# EAGLE design SegmentDriver_nh_teensy36 (EAGLE 7.7.0)

## Sheet 1 of 8: Power
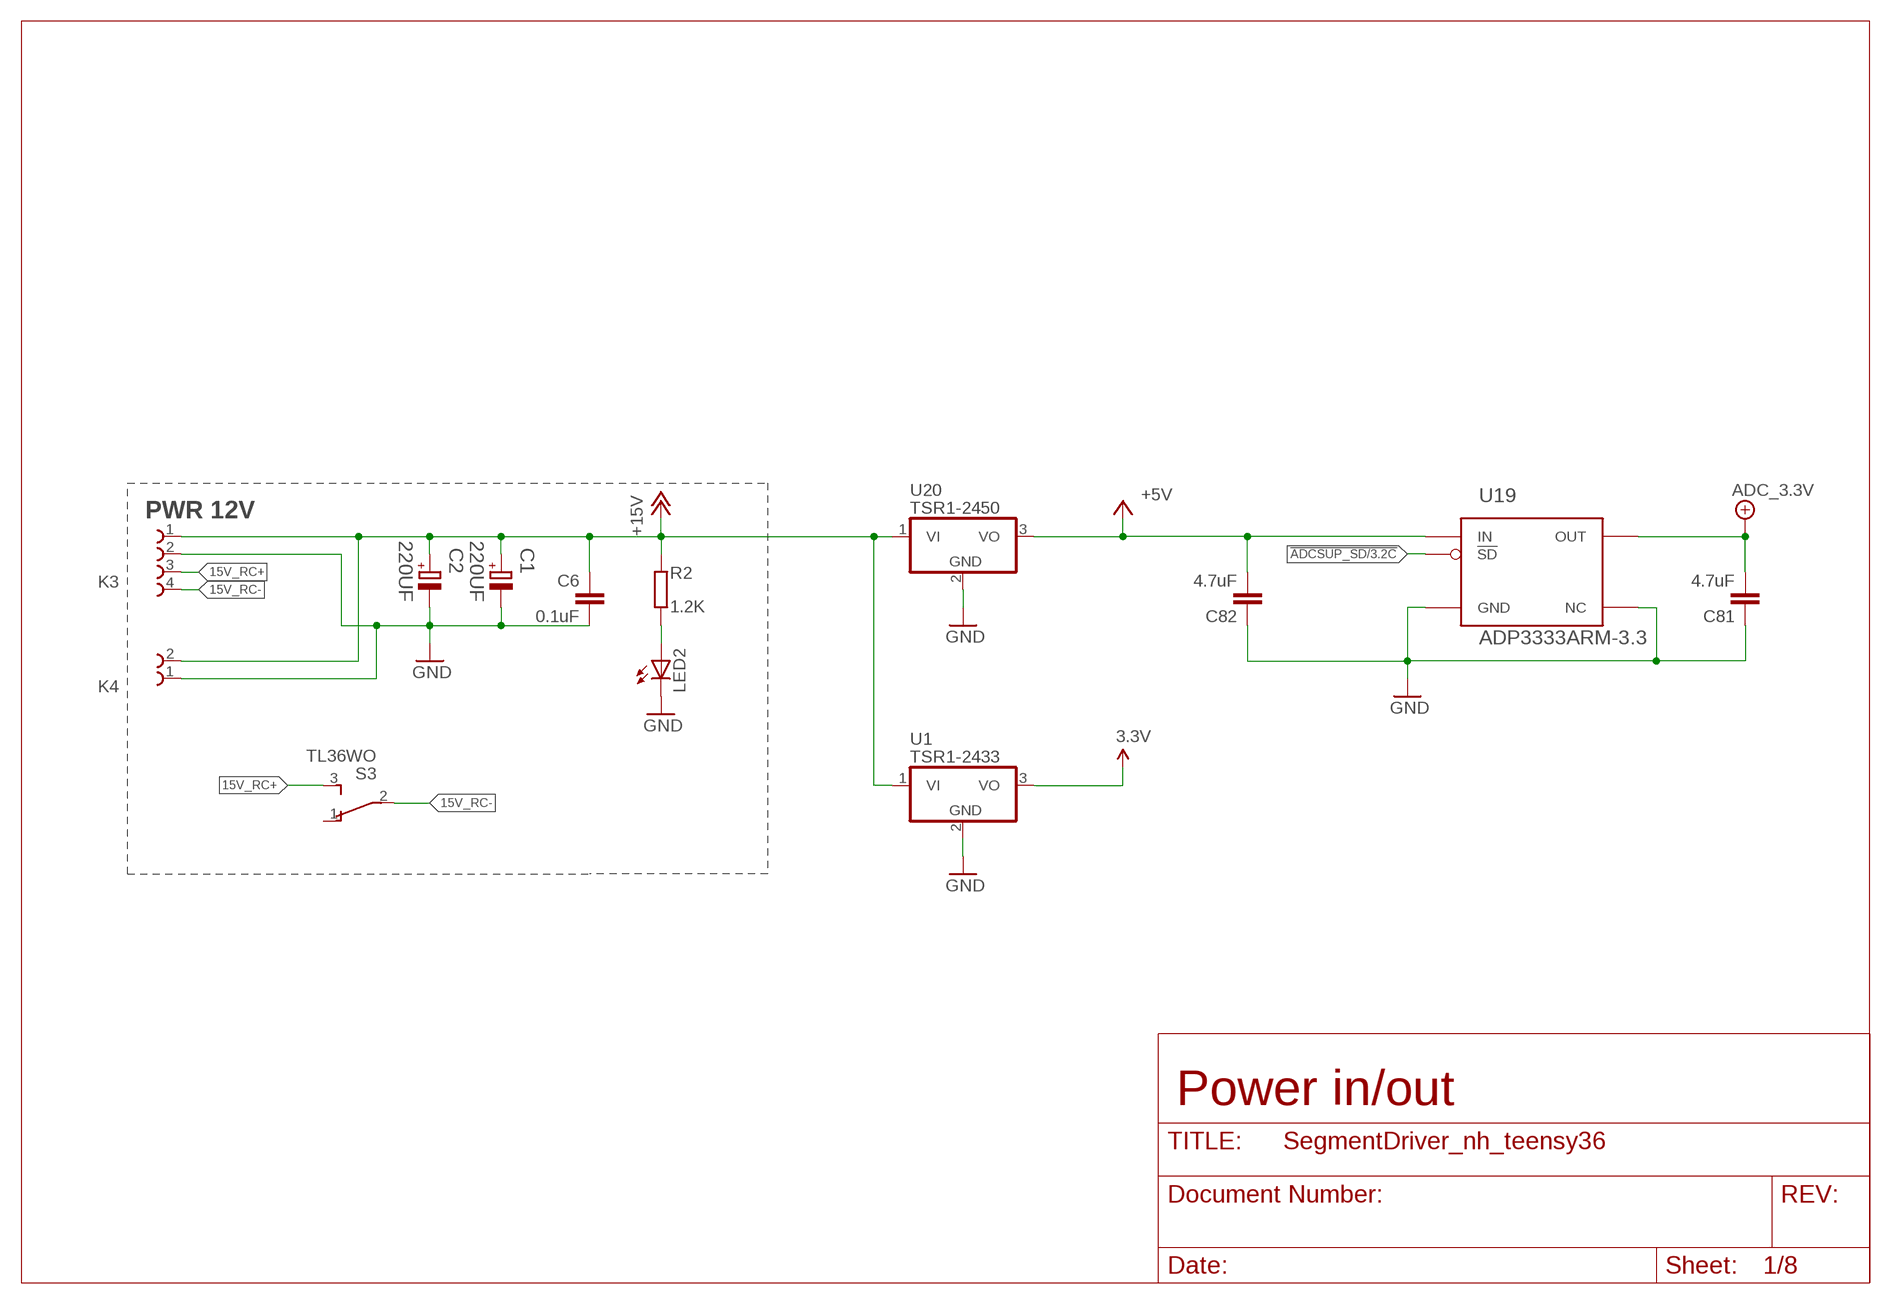
[diagram p0: schematic, sheet 1]

### Parts
C1  220UF  EEE-FP1V221AP-CASE-F  [CAPAE830X1050N]
C2  220UF  EEE-FP1V221AP-CASE-F  [CAPAE830X1050N]
C6  0.1uF  C-EUC0603K  [C0603K]
C81  4.7uF  C-EUC0603K  [C0603K]
C82  4.7uF  C-EUC0805K  [C0805K]
K3  691322310004  [691322310004]
K4  691322310002  [691322310002]
LED2  LEDCHIPLED_0603  [CHIPLED_0603]
R2  1.2K  R-EU_R0603  [R0603]
S3  TL36WO  [TL3XWO]
U1  TSR1-2433  78XXTSR1-24XX  [TO220V_TR1]
U19  ADP3333ARM-3.3  ADP3333ARM-5  [MSOP-8]
U20  TSR1-2450  78XXTSR1-24XX  [TO220V_TR1]

### Nets
3.3V: U1.3(VO) ; also sheet 2,4,7
15V_RC+: K3.3 S3.3(S)
15V_RC-: K3.4 S3.2(P)
!ADCSUP_SD: U19.7(!SD!) ; also sheet 3
+5V: C82.2 U19.2(IN) U20.3(VO) ; also sheet 7
+15V: C1.1 C2.1 C6.2 K3.1 K4.2 R2.2 U1.1(VI) U20.1(VI) ; also sheet 4
ADC_3.3V: C81.2 U19.1(OUT) ; also sheet 5
GND: C1.2 C2.2 C6.1 C81.1 C82.1 K3.2 K4.1 LED2.C U1.2(GND) U19.3(GND) U19.4(NC) U19.5(NC) U19.6(NC) U19.8(NC) U20.2(GND) ; also sheet 2,3,4,5,6,7,8
N$62: LED2.A R2.1
Unconnected: S3.1(O)

### Notes on the sheet
- PWR 12V
- Power in/out

## Sheet 2 of 8: Connectors
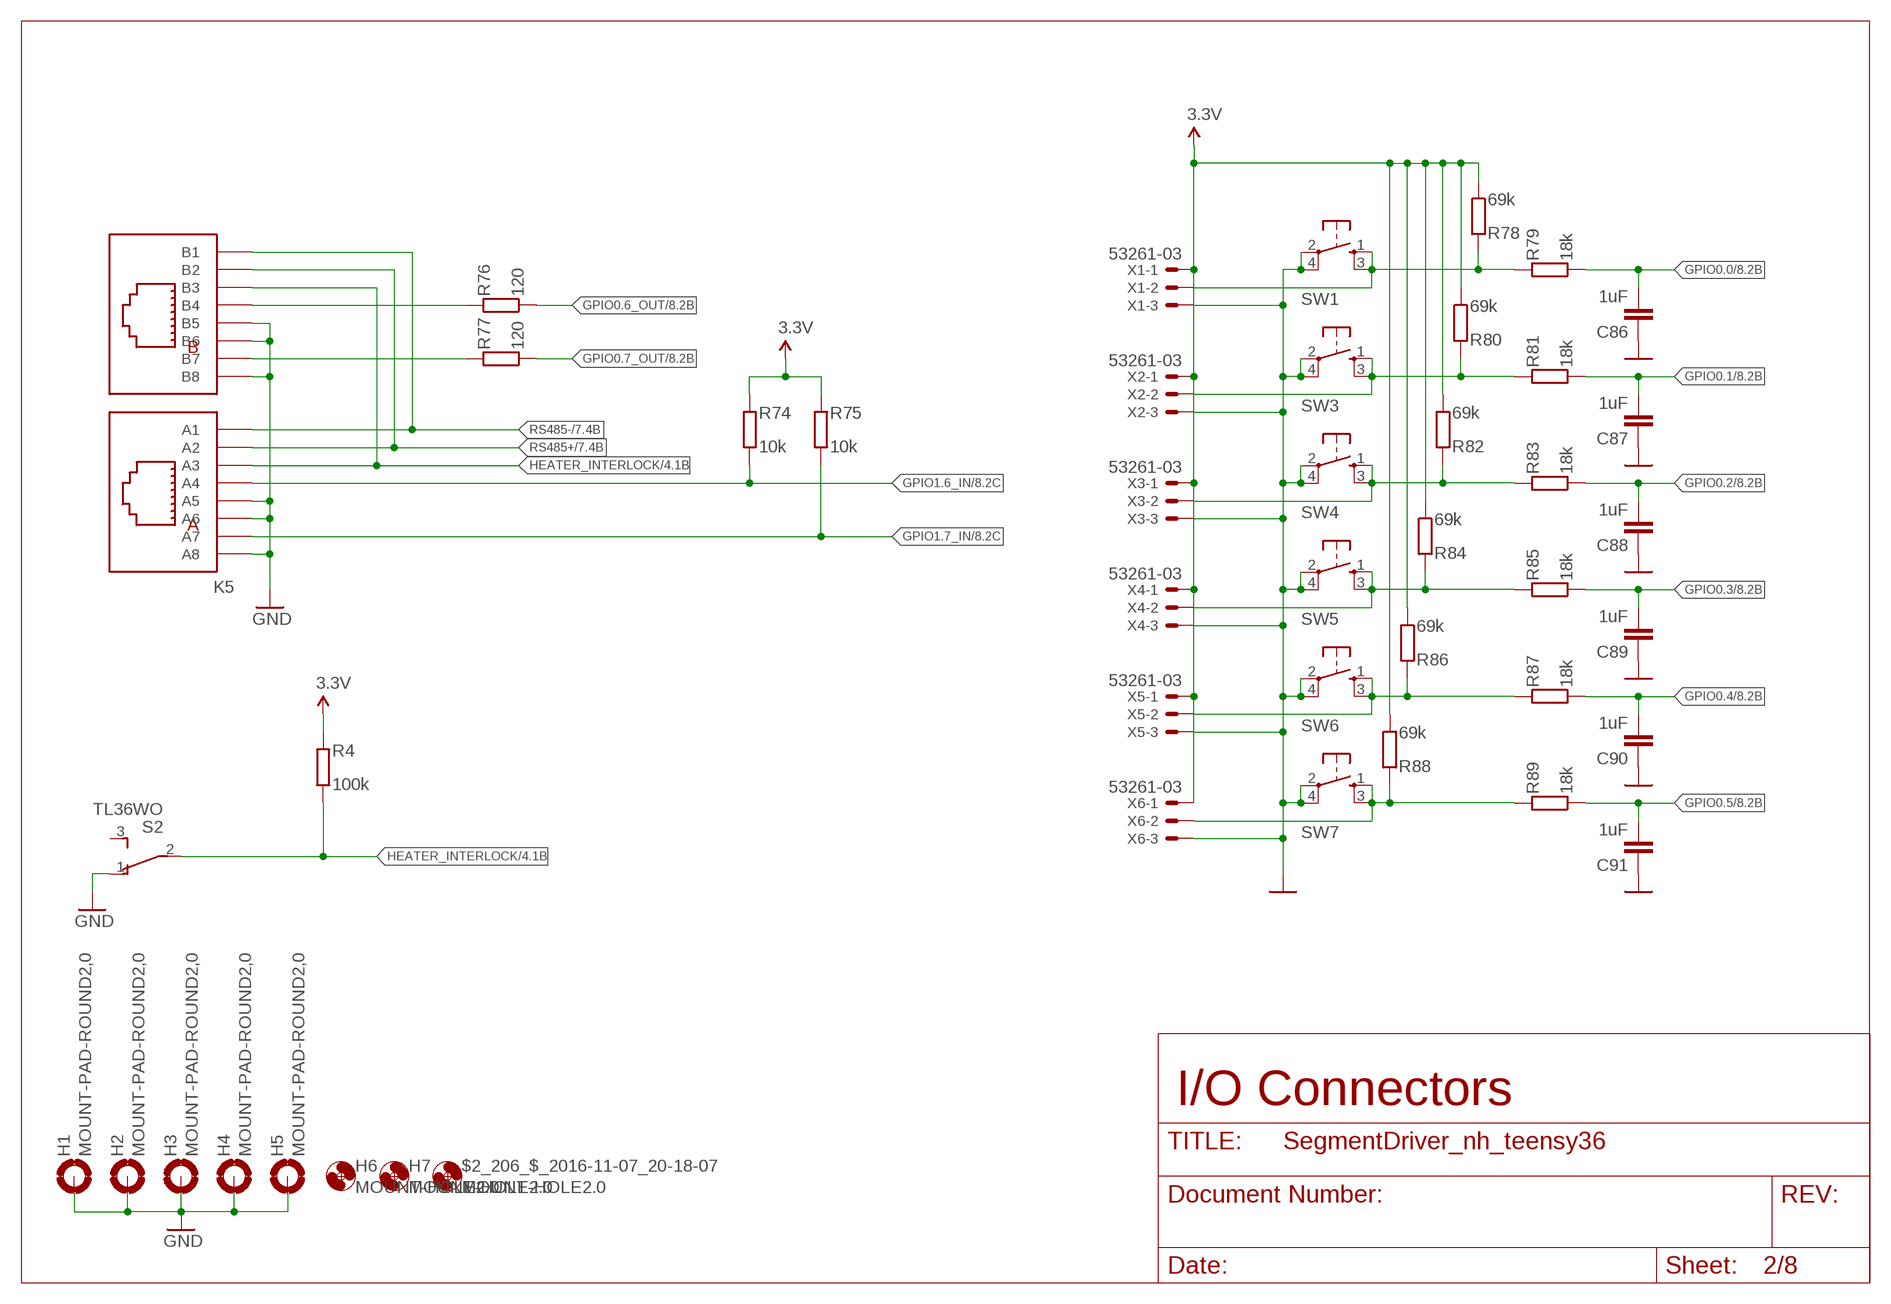
[diagram p1: schematic, sheet 2]

### Parts
$2_206_$_2016-11-07_20-18-07  MOUNT-HOLE2.0  [2,0]
C86  1uF  C-EUC0603K  [C0603K]
C87  1uF  C-EUC0603K  [C0603K]
C88  1uF  C-EUC0603K  [C0603K]
C89  1uF  C-EUC0603K  [C0603K]
C90  1uF  C-EUC0603K  [C0603K]
C91  1uF  C-EUC0603K  [C0603K]
H1  MOUNT-PAD-ROUND2,0  [2,0-PAD]
H2  MOUNT-PAD-ROUND2,0  [2,0-PAD]
H3  MOUNT-PAD-ROUND2,0  [2,0-PAD]
H4  MOUNT-PAD-ROUND2,0  [2,0-PAD]
H5  MOUNT-PAD-ROUND2,0  [2,0-PAD]
H6  MOUNT-HOLE2.0  [2,0]
H7  MOUNT-HOLE2.0  [2,0]
K5  615016149521  [615016149521]
R4  100k  R-EU_R0603  [R0603]
R74  10k  R-EU_R0603  [R0603]
R75  10k  R-EU_R0603  [R0603]
R76  120  R-EU_R0603  [R0603]
R77  120  R-EU_R0603  [R0603]
R78  69k  R-EU_R0603  [R0603]
R79  18k  R-EU_R0603  [R0603]
R80  69k  R-EU_R0603  [R0603]
R81  18k  R-EU_R0603  [R0603]
R82  69k  R-EU_R0603  [R0603]
R83  18k  R-EU_R0603  [R0603]
R84  69k  R-EU_R0603  [R0603]
R85  18k  R-EU_R0603  [R0603]
R86  69k  R-EU_R0603  [R0603]
R87  18k  R-EU_R0603  [R0603]
R88  69k  R-EU_R0603  [R0603]
R89  18k  R-EU_R0603  [R0603]
S2  TL36WO  [TL3XWO]
SW1  434153017835_FIXED  [434153017835]
SW3  434153017835_FIXED  [434153017835]
SW4  434153017835_FIXED  [434153017835]
SW5  434153017835_FIXED  [434153017835]
SW6  434153017835_FIXED  [434153017835]
SW7  434153017835_FIXED  [434153017835]
X1  53261-03  [53261-03]
X2  53261-03  [53261-03]
X3  53261-03  [53261-03]
X4  53261-03  [53261-03]
X5  53261-03  [53261-03]
X6  53261-03  [53261-03]

### Nets
3.3V: R4.2 R74.2 R75.2 R78.1 R80.1 R82.1 R84.1 R86.1 R88.1 X1.1 X2.1 X3.1 X4.1 X5.1 X6.1 ; also sheet 1,4,7
GND: C86.1 C87.1 C88.1 C89.1 C90.1 C91.1 H1.B2,2(MOUNT) H2.B2,2(MOUNT) H3.B2,2(MOUNT) H4.B2,2(MOUNT) H5.B2,2(MOUNT) K5.A5 K5.A6 K5.A8 K5.B5 K5.B6 K5.B8 S2.1(O) SW1.2 SW1.4 SW3.2 SW3.4 SW4.2 SW4.4 SW5.2 SW5.4 SW6.2 SW6.4 SW7.2 SW7.4 X1.3 X2.3 X3.3 X4.3 X5.3 X6.3 ; also sheet 1,3,4,5,6,7,8
GPIO0.0: C86.2 R79.1 ; also sheet 8
GPIO0.1: C87.2 R81.1 ; also sheet 8
GPIO0.2: C88.2 R83.1 ; also sheet 8
GPIO0.3: C89.2 R85.1 ; also sheet 8
GPIO0.4: C90.2 R87.1 ; also sheet 8
GPIO0.5: C91.2 R89.1 ; also sheet 8
GPIO0.6_OUT: R76.1 ; also sheet 8
GPIO0.7_OUT: R77.1 ; also sheet 8
GPIO1.6_IN: K5.A4 R74.1 ; also sheet 8
GPIO1.7_IN: K5.A7 R75.1 ; also sheet 8
GPIO6_OUT: K5.B4 R76.2
GPIO7_OUT: K5.B7 R77.2
HEATER_INTERLOCK: K5.A3 R4.1 S2.2(P) ; also sheet 4
N$2: K5.B3
N$64: R78.2 R79.2 SW1.1 SW1.3 X1.2
N$66: R80.2 R81.2 SW3.1 SW3.3 X2.2
N$68: R82.2 R83.2 SW4.1 SW4.3 X3.2
N$70: R84.2 R85.2 SW5.1 SW5.3 X4.2
N$72: R86.2 R87.2 SW6.1 SW6.3 X5.2
N$79: R88.2 R89.2 SW7.1 SW7.3 X6.2
RS485+: K5.A2 K5.B2 ; also sheet 7
RS485-: K5.A1 K5.B1 ; also sheet 7
Unconnected: S2.3(S)

### Notes on the sheet
- I/O Connectors

## Sheet 3 of 8: MCU
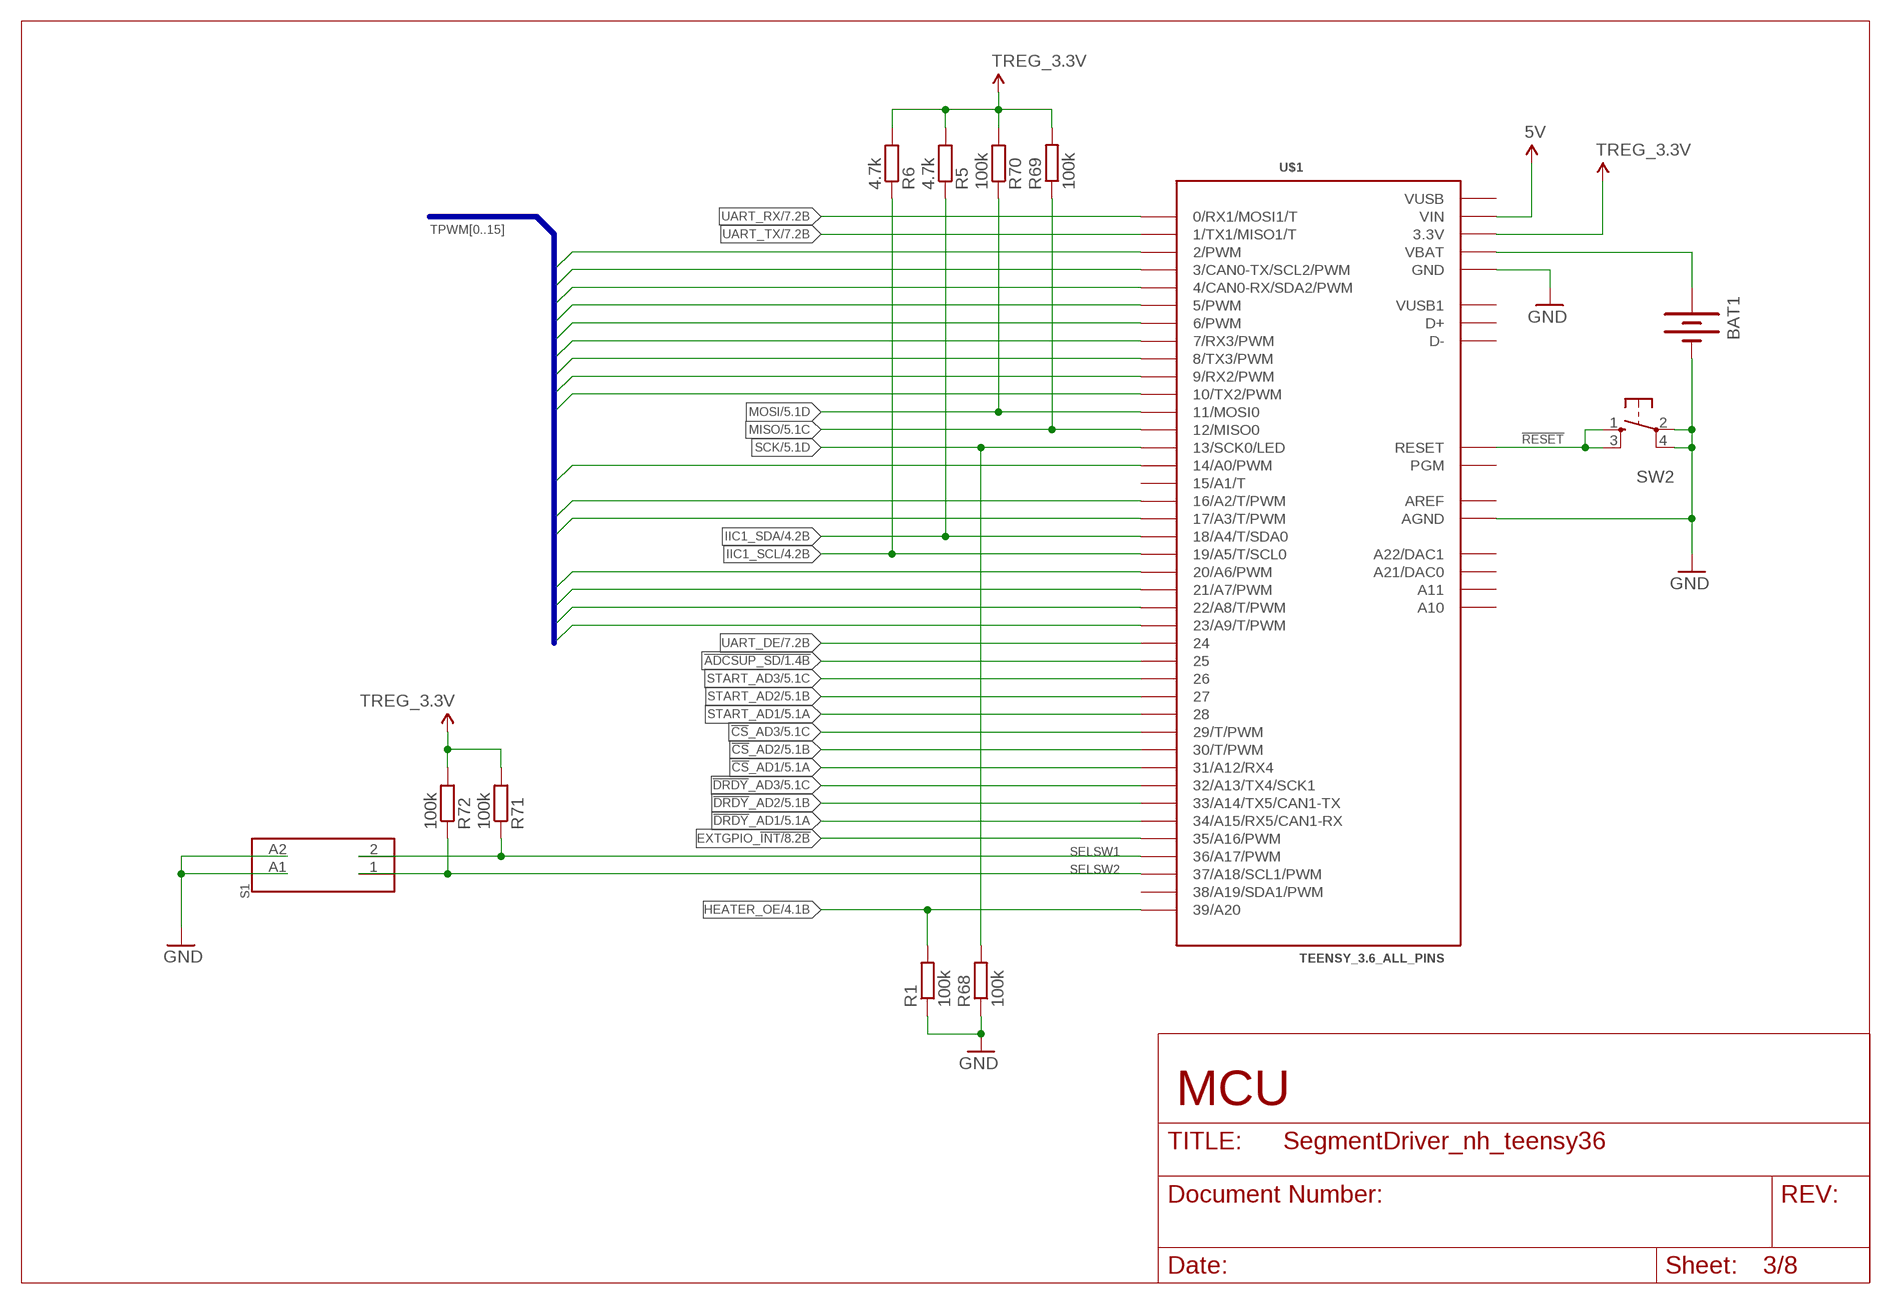
[diagram p2: schematic, sheet 3]

### Parts
BAT1  BATTERY-79528211  [79528211]
R1  100k  R-EU_R0603  [R0603]
R5  4.7k  R-EU_R0603  [R0603]
R6  4.7k  R-EU_R0603  [R0603]
R68  100k  R-EU_R0603  [R0603]
R69  100k  R-EU_R0603  [R0603]
R70  100k  R-EU_R0603  [R0603]
R71  100k  R-EU_R0603  [R0603]
R72  100k  R-EU_R0603  [R0603]
S1  418127270902  [418127270902]
SW2  434153017835_FIXED  [434153017835]
U$1  TEENSY_3.6_ALL_PINS  [TEENSY_3.6_ALL_PINS]

### Nets
5V: U$1.VIN
!ADCSUP_SD: U$1.25 ; also sheet 1
!CS!_AD1: U$1.31/A12(31/A12/RX4) ; also sheet 5
!CS!_AD2: U$1.30(30/T/PWM) ; also sheet 5
!CS!_AD3: U$1.29(29/T/PWM) ; also sheet 5
!DRDY!_AD1: U$1.34/A15(34/A15/RX5/CAN1-RX) ; also sheet 5
!DRDY!_AD2: U$1.33/A14(33/A14/TX5/CAN1-TX) ; also sheet 5
!DRDY!_AD3: U$1.32/A13(32/A13/TX4/SCK1) ; also sheet 5
!RESET: SW2.1 SW2.3 U$1.RESET
EXTGPIO_!INT: U$1.35/A16(35/A16/PWM) ; also sheet 8
GND: BAT1.- R1.1 R68.1 S1.A1 S1.A2 SW2.2 SW2.4 U$1.AGND U$1.GND U$1.GND1(GND) U$1.GND3(GND) U$1.GND4(GND) U$1.GND6(GND) ; also sheet 1,2,4,5,6,7,8
HEATER_OE: R1.2 U$1.39/A20 ; also sheet 4
IIC1_SCL: R6.1 U$1.19/A5(19/A5/T/SCL0) ; also sheet 4,8
IIC1_SDA: R5.1 U$1.18/A4(18/A4/T/SDA0) ; also sheet 4,8
MISO: R69.1 U$1.12(12/MISO0) ; also sheet 5
MOSI: R70.1 U$1.11(11/MOSI0) ; also sheet 5
N$1: BAT1.+ U$1.VBAT
SCK: R68.2 U$1.13(13/SCK0/LED) ; also sheet 5
SELSW1: R71.1 S1.2 U$1.36/A17(36/A17/PWM)
SELSW2: R72.1 S1.1 U$1.37/A18(37/A18/SCL1/PWM)
START_AD1: U$1.28 ; also sheet 5
START_AD2: U$1.27 ; also sheet 5
START_AD3: U$1.26 ; also sheet 5
TPWM0: U$1.2(2/PWM)
TPWM1: U$1.3(3/CAN0-TX/SCL2/PWM)
TPWM2: U$1.4(4/CAN0-RX/SDA2/PWM)
TPWM3: U$1.5(5/PWM)
TPWM4: U$1.6(6/PWM)
TPWM5: U$1.7(7/RX3/PWM)
TPWM6: U$1.8(8/TX3/PWM)
TPWM7: U$1.9(9/RX2/PWM)
TPWM8: U$1.10(10/TX2/PWM)
TPWM9: U$1.14/A0(14/A0/PWM)
TPWM10: U$1.16/A2(16/A2/T/PWM)
TPWM11: U$1.17/A3(17/A3/T/PWM)
TPWM12: U$1.20/A6(20/A6/PWM)
TPWM13: U$1.21/A7(21/A7/PWM)
TPWM14: U$1.22/A8(22/A8/T/PWM)
TPWM15: U$1.23/A9(23/A9/T/PWM)
TREG_3.3V: R5.2 R6.2 R69.2 R70.2 R71.2 R72.2 U$1.3.3V U$1.3.3V3(3.3V) U$1.3.3V4(3.3V) ; also sheet 8
UART_DE: U$1.24 ; also sheet 7
UART_RX: U$1.0(0/RX1/MOSI1/T) ; also sheet 7
UART_TX: U$1.1(1/TX1/MISO1/T) ; also sheet 7
Unconnected: U$1.15/A1(15/A1/T) U$1.38/A19(38/A19/SDA1/PWM) U$1.A10 U$1.A11 U$1.A21(A21/DAC0) U$1.A22(A22/DAC1) U$1.D+ U$1.D- U$1.PGM

### Buses
TPWM[0..15]

### Notes on the sheet
- MCU

## Sheet 4 of 8: Heater PWM control
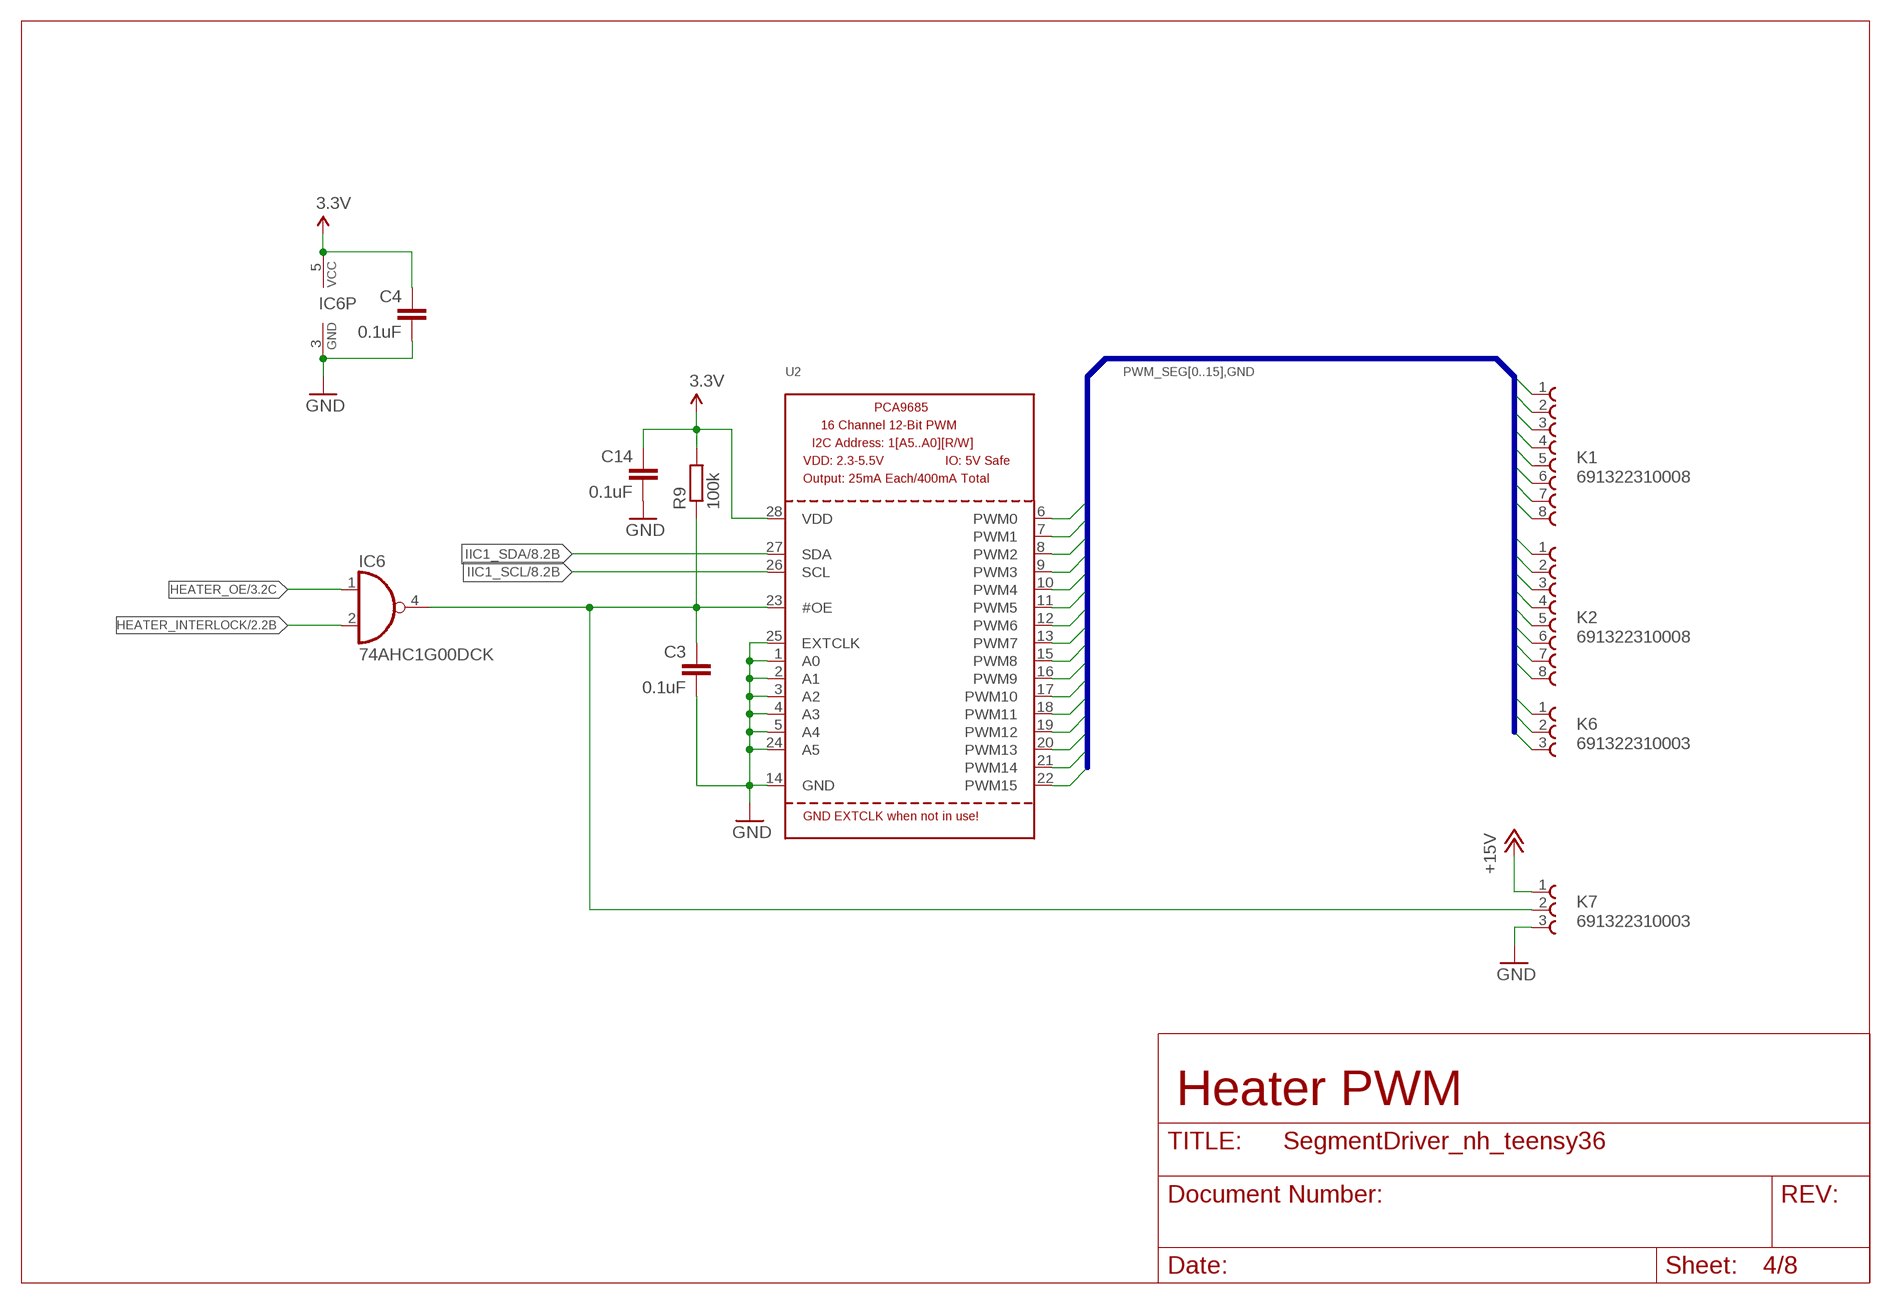
[diagram p3: schematic, sheet 4]

### Parts
C3  0.1uF  C-EUC0603K  [C0603K]
C4  0.1uF  C-EUC0603K  [C0603K]
C14  0.1uF  C-EUC0603K  [C0603K]
IC6  74AHC1G00DCK  [SC70-5]
K1  691322310008  [691322310008]
K2  691322310008  [691322310008]
K6  691322310003  [691322310003]
K7  691322310003  [691322310003]
R9  100k  R-EU_R0603  [R0603]
U2  PCA9685  [TSSOP28]

### Nets
3.3V: C4.1 C14.1 IC6.5(VCC) R9.2 U2.28(VDD) ; also sheet 1,2,7
+15V: K7.1 ; also sheet 1
GND: C3.2 C4.2 C14.2 IC6.3(GND) K1.1 K2.1 K6.1 K7.3 U2.1(A0) U2.2(A1) U2.3(A2) U2.4(A3) U2.5(A4) U2.14(GND) U2.24(A5) U2.25(EXTCLK) ; also sheet 1,2,3,5,6,7,8
HEATER_INTERLOCK: IC6.2(I1) ; also sheet 2
HEATER_OE: IC6.1(I0) ; also sheet 3
HEATER_PWR_EN: C3.1 IC6.4(O) K7.2 R9.1 U2.23(#OE)
IIC1_SCL: U2.26(SCL) ; also sheet 3,8
IIC1_SDA: U2.27(SDA) ; also sheet 3,8
PWM_SEG0: K1.2 U2.6(PWM0)
PWM_SEG1: K1.3 U2.7(PWM1)
PWM_SEG2: K1.4 U2.8(PWM2)
PWM_SEG3: K1.5 U2.9(PWM3)
PWM_SEG4: K1.6 U2.10(PWM4)
PWM_SEG5: K1.7 U2.11(PWM5)
PWM_SEG6: K1.8 U2.12(PWM6)
PWM_SEG7: K2.2 U2.13(PWM7)
PWM_SEG8: K2.3 U2.15(PWM8)
PWM_SEG9: K2.4 U2.16(PWM9)
PWM_SEG10: K2.5 U2.17(PWM10)
PWM_SEG11: K2.6 U2.18(PWM11)
PWM_SEG12: K2.7 U2.19(PWM12)
PWM_SEG13: K2.8 U2.20(PWM13)
PWM_SEG14: K6.2 U2.21(PWM14)
PWM_SEG15: K6.3 U2.22(PWM15)

### Buses
PWM_SEG[0..15],GND

### Notes on the sheet
- Heater PWM

## Sheet 5 of 8: RTD ADS
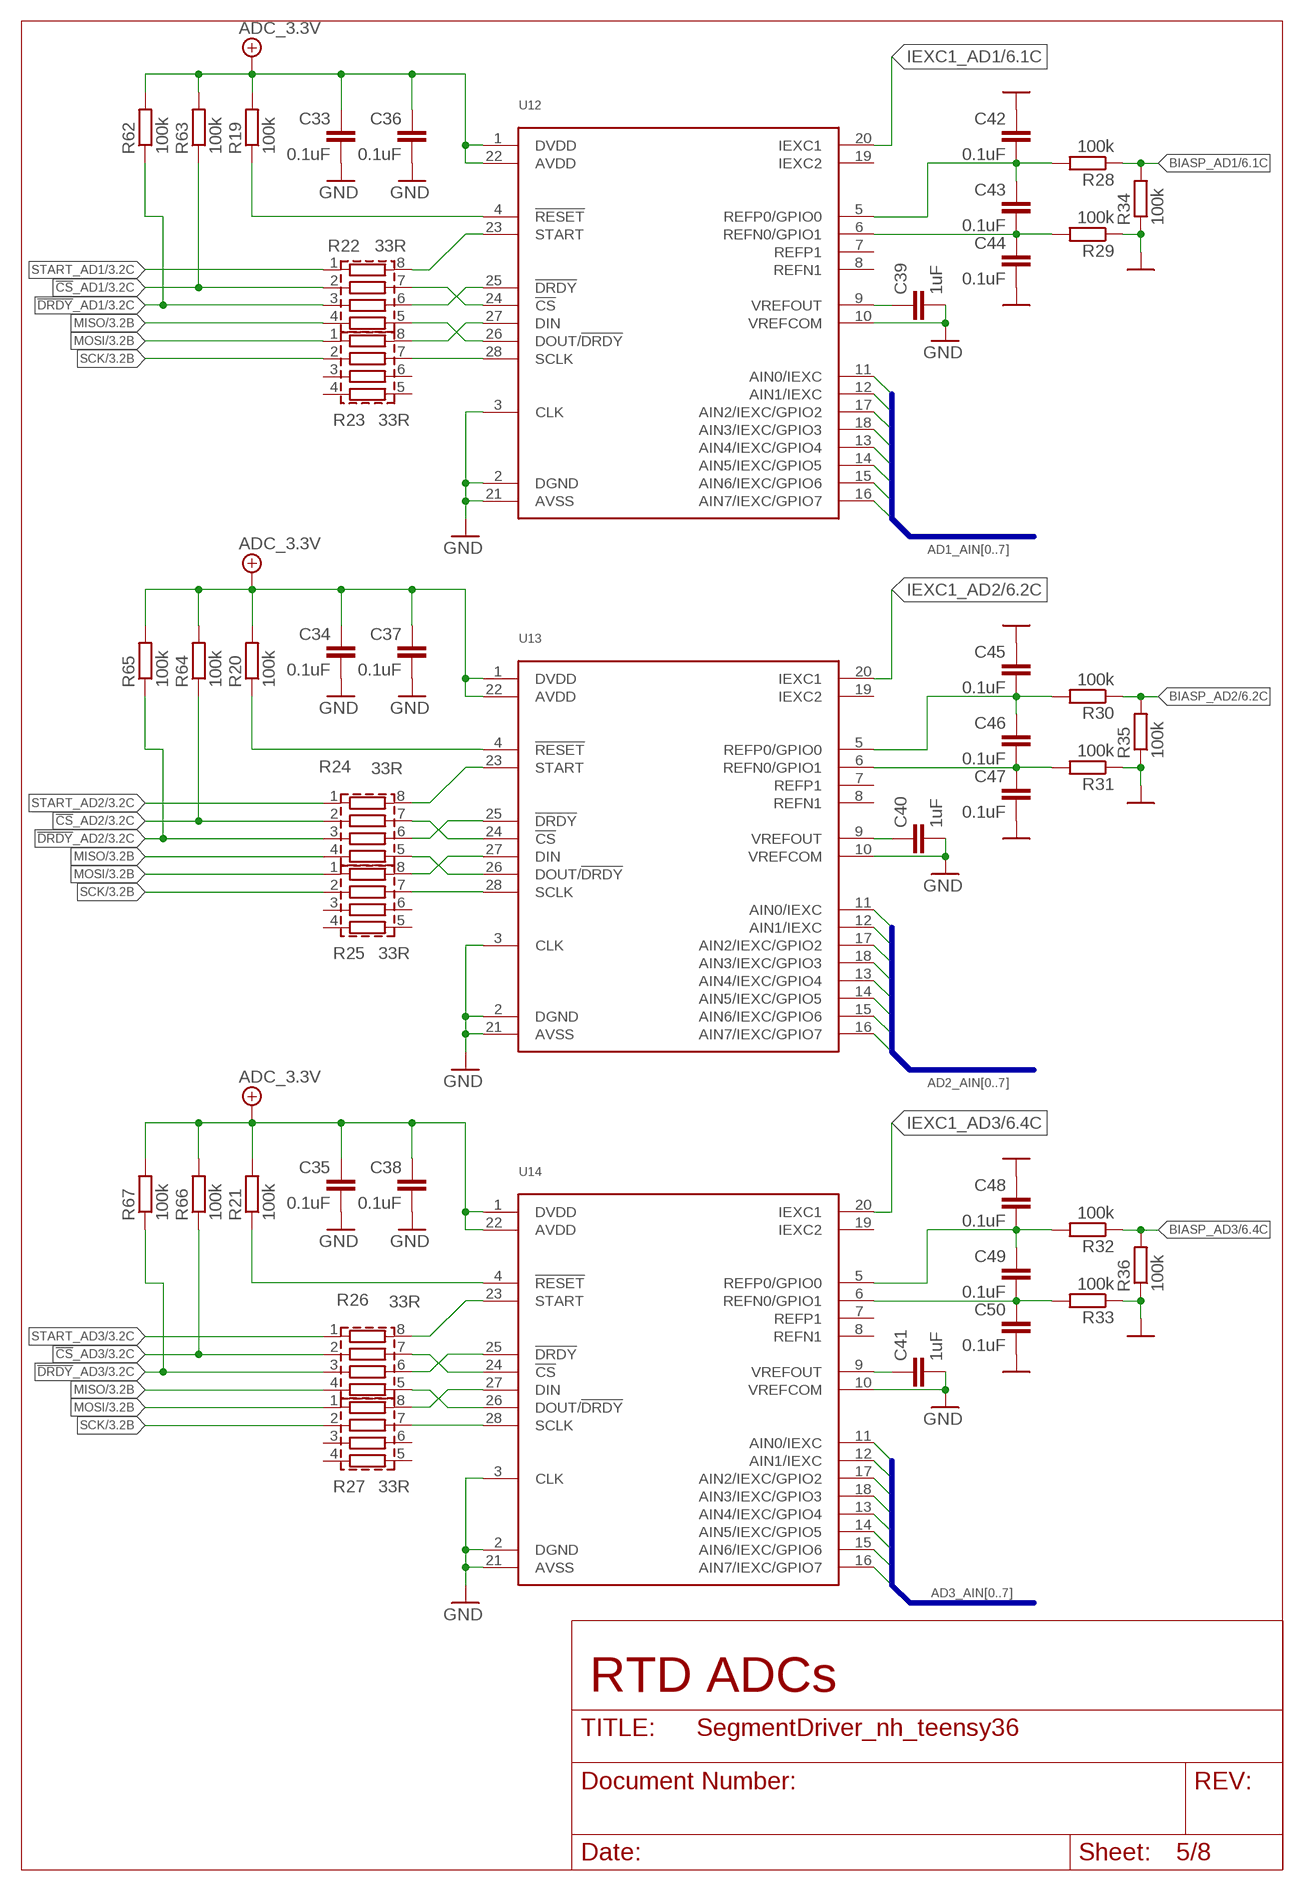
[diagram p4: schematic, sheet 5]

### Parts
C33  0.1uF  C-EUC0603K  [C0603K]
C34  0.1uF  C-EUC0603K  [C0603K]
C35  0.1uF  C-EUC0603K  [C0603K]
C36  0.1uF  C-EUC0603K  [C0603K]
C37  0.1uF  C-EUC0603K  [C0603K]
C38  0.1uF  C-EUC0603K  [C0603K]
C39  1uF  C-EUC0603K  [C0603K]
C40  1uF  C-EUC0603K  [C0603K]
C41  1uF  C-EUC0603K  [C0603K]
C42  0.1uF  C-EUC0603K  [C0603K]
C43  0.1uF  C-EUC0603K  [C0603K]
C44  0.1uF  C-EUC0603K  [C0603K]
C45  0.1uF  C-EUC0603K  [C0603K]
C46  0.1uF  C-EUC0603K  [C0603K]
C47  0.1uF  C-EUC0603K  [C0603K]
C48  0.1uF  C-EUC0603K  [C0603K]
C49  0.1uF  C-EUC0603K  [C0603K]
C50  0.1uF  C-EUC0603K  [C0603K]
R19  100k  R-EU_R0603  [R0603]
R20  100k  R-EU_R0603  [R0603]
R21  100k  R-EU_R0603  [R0603]
R22  33R  EXBV8V330JV  [RESCAV80P320X160X70-8N]
R23  33R  EXBV8V330JV  [RESCAV80P320X160X70-8N]
R24  33R  EXBV8V330JV  [RESCAV80P320X160X70-8N]
R25  33R  EXBV8V330JV  [RESCAV80P320X160X70-8N]
R26  33R  EXBV8V330JV  [RESCAV80P320X160X70-8N]
R27  33R  EXBV8V330JV  [RESCAV80P320X160X70-8N]
R28  100k  R-EU_R0603  [R0603]
R29  100k  R-EU_R0603  [R0603]
R30  100k  R-EU_R0603  [R0603]
R31  100k  R-EU_R0603  [R0603]
R32  100k  R-EU_R0603  [R0603]
R33  100k  R-EU_R0603  [R0603]
R34  100k  R-EU_R0603  [R0603]
R35  100k  R-EU_R0603  [R0603]
R36  100k  R-EU_R0603  [R0603]
R62  100k  R-EU_R0603  [R0603]
R63  100k  R-EU_R0603  [R0603]
R64  100k  R-EU_R0603  [R0603]
R65  100k  R-EU_R0603  [R0603]
R66  100k  R-EU_R0603  [R0603]
R67  100k  R-EU_R0603  [R0603]
U12  ADS1X48IPW  [TSSOP28]
U13  ADS1X48IPW  [TSSOP28]
U14  ADS1X48IPW  [TSSOP28]

### Nets
9_AD1: C39.1 U12.9(VREFOUT)
9_AD2: C40.1 U13.9(VREFOUT)
9_AD3: C41.1 U14.9(VREFOUT)
23_AD1: R22.8 U12.23(START)
23_AD2: R24.8 U13.23(START)
23_AD3: R26.8 U14.23(START)
24_AD1: R22.7 U12.24(!CS!)
24_AD2: R24.7 U13.24(!CS!)
24_AD3: R26.7 U14.24(!CS!)
25_AD1: R22.6 U12.25(!DRDY!)
25_AD2: R24.6 U13.25(!DRDY!)
25_AD3: R26.6 U14.25(!DRDY!)
26_AD1: R22.5 U12.26(DOUT/!DRDY!)
26_AD2: R24.5 U13.26(DOUT/!DRDY!)
26_AD3: R26.5 U14.26(DOUT/!DRDY!)
27_AD1: R23.8 U12.27(DIN)
27_AD2: R25.8 U13.27(DIN)
27_AD3: R27.8 U14.27(DIN)
28_AD1: R23.7 U12.28(SCLK)
28_AD2: R25.7 U13.28(SCLK)
28_AD3: R27.7 U14.28(SCLK)
!CS!_AD1: R22.2 R63.1 ; also sheet 3
!CS!_AD2: R24.2 R64.1 ; also sheet 3
!CS!_AD3: R26.2 R66.1 ; also sheet 3
!DRDY!_AD1: R22.3 R62.1 ; also sheet 3
!DRDY!_AD2: R24.3 R65.1 ; also sheet 3
!DRDY!_AD3: R26.3 R67.1 ; also sheet 3
!RESET!_AD1: R19.1 U12.4(!RESET!)
!RESET!_AD2: R20.1 U13.4(!RESET!)
!RESET!_AD3: R21.1 U14.4(!RESET!)
AD1_AIN0: U12.11(AIN0/IEXC) ; also sheet 6
AD1_AIN1: U12.12(AIN1/IEXC) ; also sheet 6
AD1_AIN2: U12.17(AIN2/IEXC/GPIO2) ; also sheet 6
AD1_AIN3: U12.18(AIN3/IEXC/GPIO3) ; also sheet 6
AD1_AIN4: U12.13(AIN4/IEXC/GPIO4) ; also sheet 6
AD1_AIN5: U12.14(AIN5/IEXC/GPIO5) ; also sheet 6
AD1_AIN6: U12.15(AIN6/IEXC/GPIO6) ; also sheet 6
AD1_AIN7: U12.16(AIN7/IEXC/GPIO7) ; also sheet 6
AD2_AIN0: U13.11(AIN0/IEXC) ; also sheet 6
AD2_AIN1: U13.12(AIN1/IEXC) ; also sheet 6
AD2_AIN2: U13.17(AIN2/IEXC/GPIO2) ; also sheet 6
AD2_AIN3: U13.18(AIN3/IEXC/GPIO3) ; also sheet 6
AD2_AIN4: U13.13(AIN4/IEXC/GPIO4) ; also sheet 6
AD2_AIN5: U13.14(AIN5/IEXC/GPIO5) ; also sheet 6
AD2_AIN6: U13.15(AIN6/IEXC/GPIO6) ; also sheet 6
AD2_AIN7: U13.16(AIN7/IEXC/GPIO7) ; also sheet 6
AD3_AIN0: U14.11(AIN0/IEXC) ; also sheet 6
AD3_AIN1: U14.12(AIN1/IEXC) ; also sheet 6
AD3_AIN2: U14.17(AIN2/IEXC/GPIO2) ; also sheet 6
AD3_AIN3: U14.18(AIN3/IEXC/GPIO3) ; also sheet 6
AD3_AIN4: U14.13(AIN4/IEXC/GPIO4) ; also sheet 6
AD3_AIN5: U14.14(AIN5/IEXC/GPIO5) ; also sheet 6
AD3_AIN6: U14.15(AIN6/IEXC/GPIO6) ; also sheet 6
AD3_AIN7: U14.16(AIN7/IEXC/GPIO7) ; also sheet 6
ADC_3.3V: C33.1 C34.1 C35.1 C36.1 C37.1 C38.1 R19.2 R20.2 R21.2 R62.2 R63.2 R64.2 R65.2 R66.2 R67.2 U12.1(DVDD) U12.22(AVDD) U13.1(DVDD) U13.22(AVDD) U14.1(DVDD) U14.22(AVDD) ; also sheet 1
BIASP_AD1: R28.1 R34.2 ; also sheet 6
BIASP_AD2: R30.1 R35.2 ; also sheet 6
BIASP_AD3: R32.1 R36.2 ; also sheet 6
GND: C33.2 C34.2 C35.2 C36.2 C37.2 C38.2 C39.2 C40.2 C41.2 C42.1 C44.2 C45.1 C47.2 C48.1 C50.2 R29.1 R31.1 R33.1 R34.1 R35.1 R36.1 U12.2(DGND) U12.3(CLK) U12.10(VREFCOM) U12.21(AVSS) U13.2(DGND) U13.3(CLK) U13.10(VREFCOM) U13.21(AVSS) U14.2(DGND) U14.3(CLK) U14.10(VREFCOM) U14.21(AVSS) ; also sheet 1,2,3,4,6,7,8
IEXC1_AD1: U12.20(IEXC1) ; also sheet 6
IEXC1_AD2: U13.20(IEXC1) ; also sheet 6
IEXC1_AD3: U14.20(IEXC1) ; also sheet 6
MISO: R22.4 R24.4 R26.4 ; also sheet 3
MOSI: R23.1 R25.1 R27.1 ; also sheet 3
REFN0_AD1: C43.2 C44.1 R29.2 U12.6(REFN0/GPIO1)
REFN0_AD2: C46.2 C47.1 R31.2 U13.6(REFN0/GPIO1)
REFN0_AD3: C49.2 C50.1 R33.2 U14.6(REFN0/GPIO1)
REFP0_AD1: C42.2 C43.1 R28.2 U12.5(REFP0/GPIO0)
REFP0_AD2: C45.2 C46.1 R30.2 U13.5(REFP0/GPIO0)
REFP0_AD3: C48.2 C49.1 R32.2 U14.5(REFP0/GPIO0)
SCK: R23.2 R25.2 R27.2 ; also sheet 3
START_AD1: R22.1 ; also sheet 3
START_AD2: R24.1 ; also sheet 3
START_AD3: R26.1 ; also sheet 3
Unconnected: R23.3 R23.4 R23.5 R23.6 R25.3 R25.4 R25.5 R25.6 R27.3 R27.4 R27.5 R27.6 U12.7(REFP1) U12.8(REFN1) U12.19(IEXC2) U13.7(REFP1) U13.8(REFN1) U13.19(IEXC2) U14.7(REFP1) U14.8(REFN1) U14.19(IEXC2)

### Buses
AD1_AIN[0..7]
AD2_AIN[0..7]
AD3_AIN[0..7]

### Notes on the sheet
- RTD ADCs

## Sheet 6 of 8: RTD Input & differential filtering
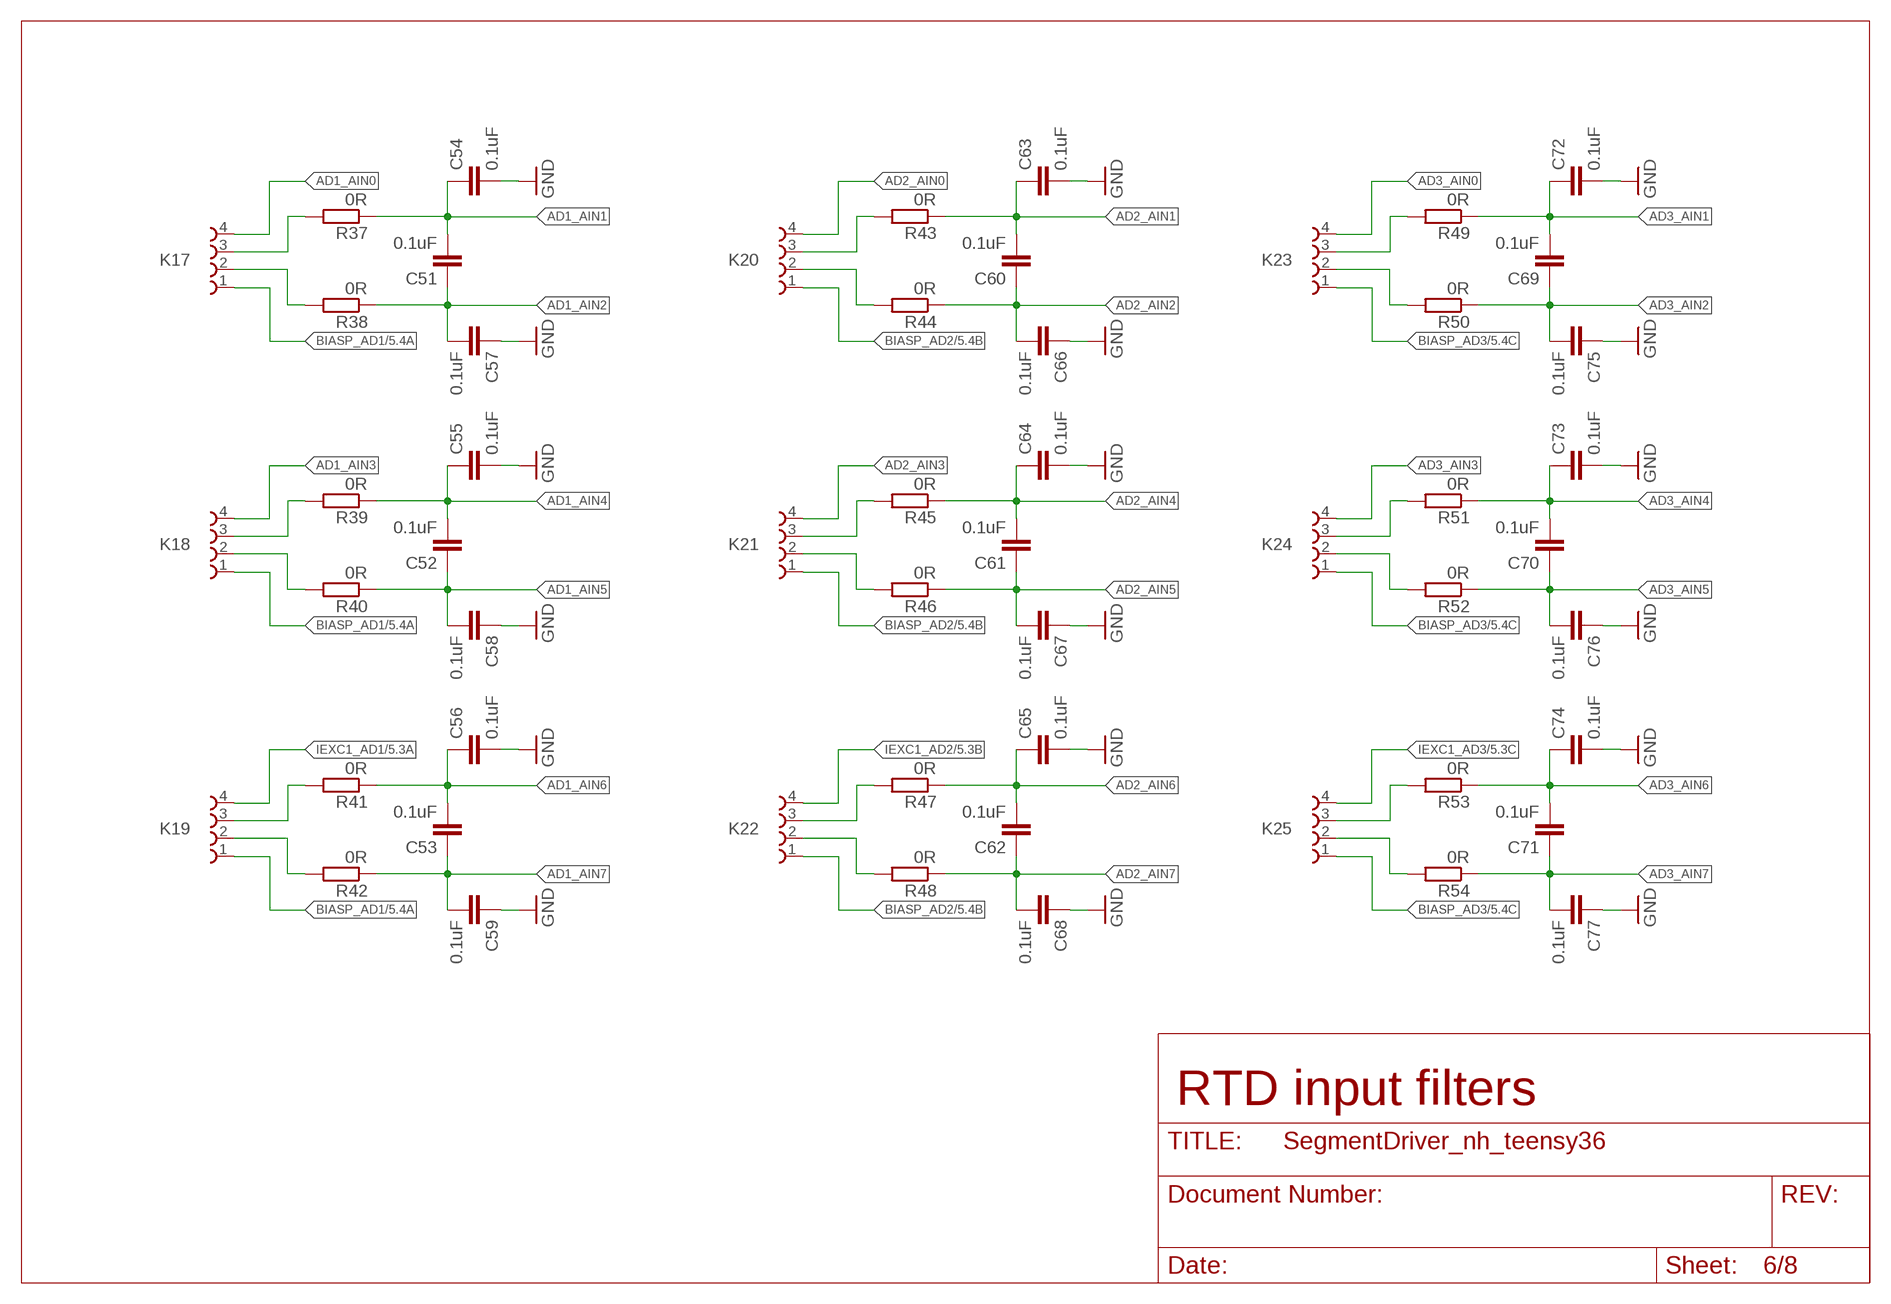
[diagram p5: schematic, sheet 6]

### Parts
C51  0.1uF  C-EUC0603K  [C0603K]
C52  0.1uF  C-EUC0603K  [C0603K]
C53  0.1uF  C-EUC0603K  [C0603K]
C54  0.1uF  C-EUC0603K  [C0603K]
C55  0.1uF  C-EUC0603K  [C0603K]
C56  0.1uF  C-EUC0603K  [C0603K]
C57  0.1uF  C-EUC0603K  [C0603K]
C58  0.1uF  C-EUC0603K  [C0603K]
C59  0.1uF  C-EUC0603K  [C0603K]
C60  0.1uF  C-EUC0603K  [C0603K]
C61  0.1uF  C-EUC0603K  [C0603K]
C62  0.1uF  C-EUC0603K  [C0603K]
C63  0.1uF  C-EUC0603K  [C0603K]
C64  0.1uF  C-EUC0603K  [C0603K]
C65  0.1uF  C-EUC0603K  [C0603K]
C66  0.1uF  C-EUC0603K  [C0603K]
C67  0.1uF  C-EUC0603K  [C0603K]
C68  0.1uF  C-EUC0603K  [C0603K]
C69  0.1uF  C-EUC0603K  [C0603K]
C70  0.1uF  C-EUC0603K  [C0603K]
C71  0.1uF  C-EUC0603K  [C0603K]
C72  0.1uF  C-EUC0603K  [C0603K]
C73  0.1uF  C-EUC0603K  [C0603K]
C74  0.1uF  C-EUC0603K  [C0603K]
C75  0.1uF  C-EUC0603K  [C0603K]
C76  0.1uF  C-EUC0603K  [C0603K]
C77  0.1uF  C-EUC0603K  [C0603K]
K17  691210910004  [691210910004]
K18  691210910004  [691210910004]
K19  691210910004  [691210910004]
K20  691210910004  [691210910004]
K21  691210910004  [691210910004]
K22  691210910004  [691210910004]
K23  691210910004  [691210910004]
K24  691210910004  [691210910004]
K25  691210910004  [691210910004]
R37  0R  R-EU_R0603  [R0603]
R38  0R  R-EU_R0603  [R0603]
R39  0R  R-EU_R0603  [R0603]
R40  0R  R-EU_R0603  [R0603]
R41  0R  R-EU_R0603  [R0603]
R42  0R  R-EU_R0603  [R0603]
R43  0R  R-EU_R0603  [R0603]
R44  0R  R-EU_R0603  [R0603]
R45  0R  R-EU_R0603  [R0603]
R46  0R  R-EU_R0603  [R0603]
R47  0R  R-EU_R0603  [R0603]
R48  0R  R-EU_R0603  [R0603]
R49  0R  R-EU_R0603  [R0603]
R50  0R  R-EU_R0603  [R0603]
R51  0R  R-EU_R0603  [R0603]
R52  0R  R-EU_R0603  [R0603]
R53  0R  R-EU_R0603  [R0603]
R54  0R  R-EU_R0603  [R0603]

### Nets
AD1_AIN0: K17.4 ; also sheet 5
AD1_AIN1: C51.2 C54.1 R37.1 ; also sheet 5
AD1_AIN2: C51.1 C57.2 R38.1 ; also sheet 5
AD1_AIN3: K18.4 ; also sheet 5
AD1_AIN4: C52.2 C55.1 R39.1 ; also sheet 5
AD1_AIN5: C52.1 C58.2 R40.1 ; also sheet 5
AD1_AIN6: C53.2 C56.1 R41.1 ; also sheet 5
AD1_AIN7: C53.1 C59.2 R42.1 ; also sheet 5
AD2_AIN0: K20.4 ; also sheet 5
AD2_AIN1: C60.2 C63.1 R43.1 ; also sheet 5
AD2_AIN2: C60.1 C66.2 R44.1 ; also sheet 5
AD2_AIN3: K21.4 ; also sheet 5
AD2_AIN4: C61.2 C64.1 R45.1 ; also sheet 5
AD2_AIN5: C61.1 C67.2 R46.1 ; also sheet 5
AD2_AIN6: C62.2 C65.1 R47.1 ; also sheet 5
AD2_AIN7: C62.1 C68.2 R48.1 ; also sheet 5
AD3_AIN0: K23.4 ; also sheet 5
AD3_AIN1: C69.2 C72.1 R49.1 ; also sheet 5
AD3_AIN2: C69.1 C75.2 R50.1 ; also sheet 5
AD3_AIN3: K24.4 ; also sheet 5
AD3_AIN4: C70.2 C73.1 R51.1 ; also sheet 5
AD3_AIN5: C70.1 C76.2 R52.1 ; also sheet 5
AD3_AIN6: C71.2 C74.1 R53.1 ; also sheet 5
AD3_AIN7: C71.1 C77.2 R54.1 ; also sheet 5
BIASP_AD1: K17.1 K18.1 K19.1 ; also sheet 5
BIASP_AD2: K20.1 K21.1 K22.1 ; also sheet 5
BIASP_AD3: K23.1 K24.1 K25.1 ; also sheet 5
GND: C54.2 C55.2 C56.2 C57.1 C58.1 C59.1 C63.2 C64.2 C65.2 C66.1 C67.1 C68.1 C72.2 C73.2 C74.2 C75.1 C76.1 C77.1 ; also sheet 1,2,3,4,5,7,8
IEXC1_AD1: K19.4 ; also sheet 5
IEXC1_AD2: K22.4 ; also sheet 5
IEXC1_AD3: K25.4 ; also sheet 5
N$20: K18.3 R39.2
N$22: K18.2 R40.2
N$23: K17.3 R37.2
N$27: K17.2 R38.2
N$28: K19.3 R41.2
N$31: K19.2 R42.2
N$34: K20.3 R43.2
N$35: K20.2 R44.2
N$42: K21.3 R45.2
N$43: K21.2 R46.2
N$44: K22.3 R47.2
N$45: K22.2 R48.2
N$46: K23.3 R49.2
N$48: K23.2 R50.2
N$49: K24.3 R51.2
N$50: K24.2 R52.2
N$51: K25.3 R53.2
N$52: K25.2 R54.2

### Notes on the sheet
- RTD input filters

## Sheet 7 of 8: RS485
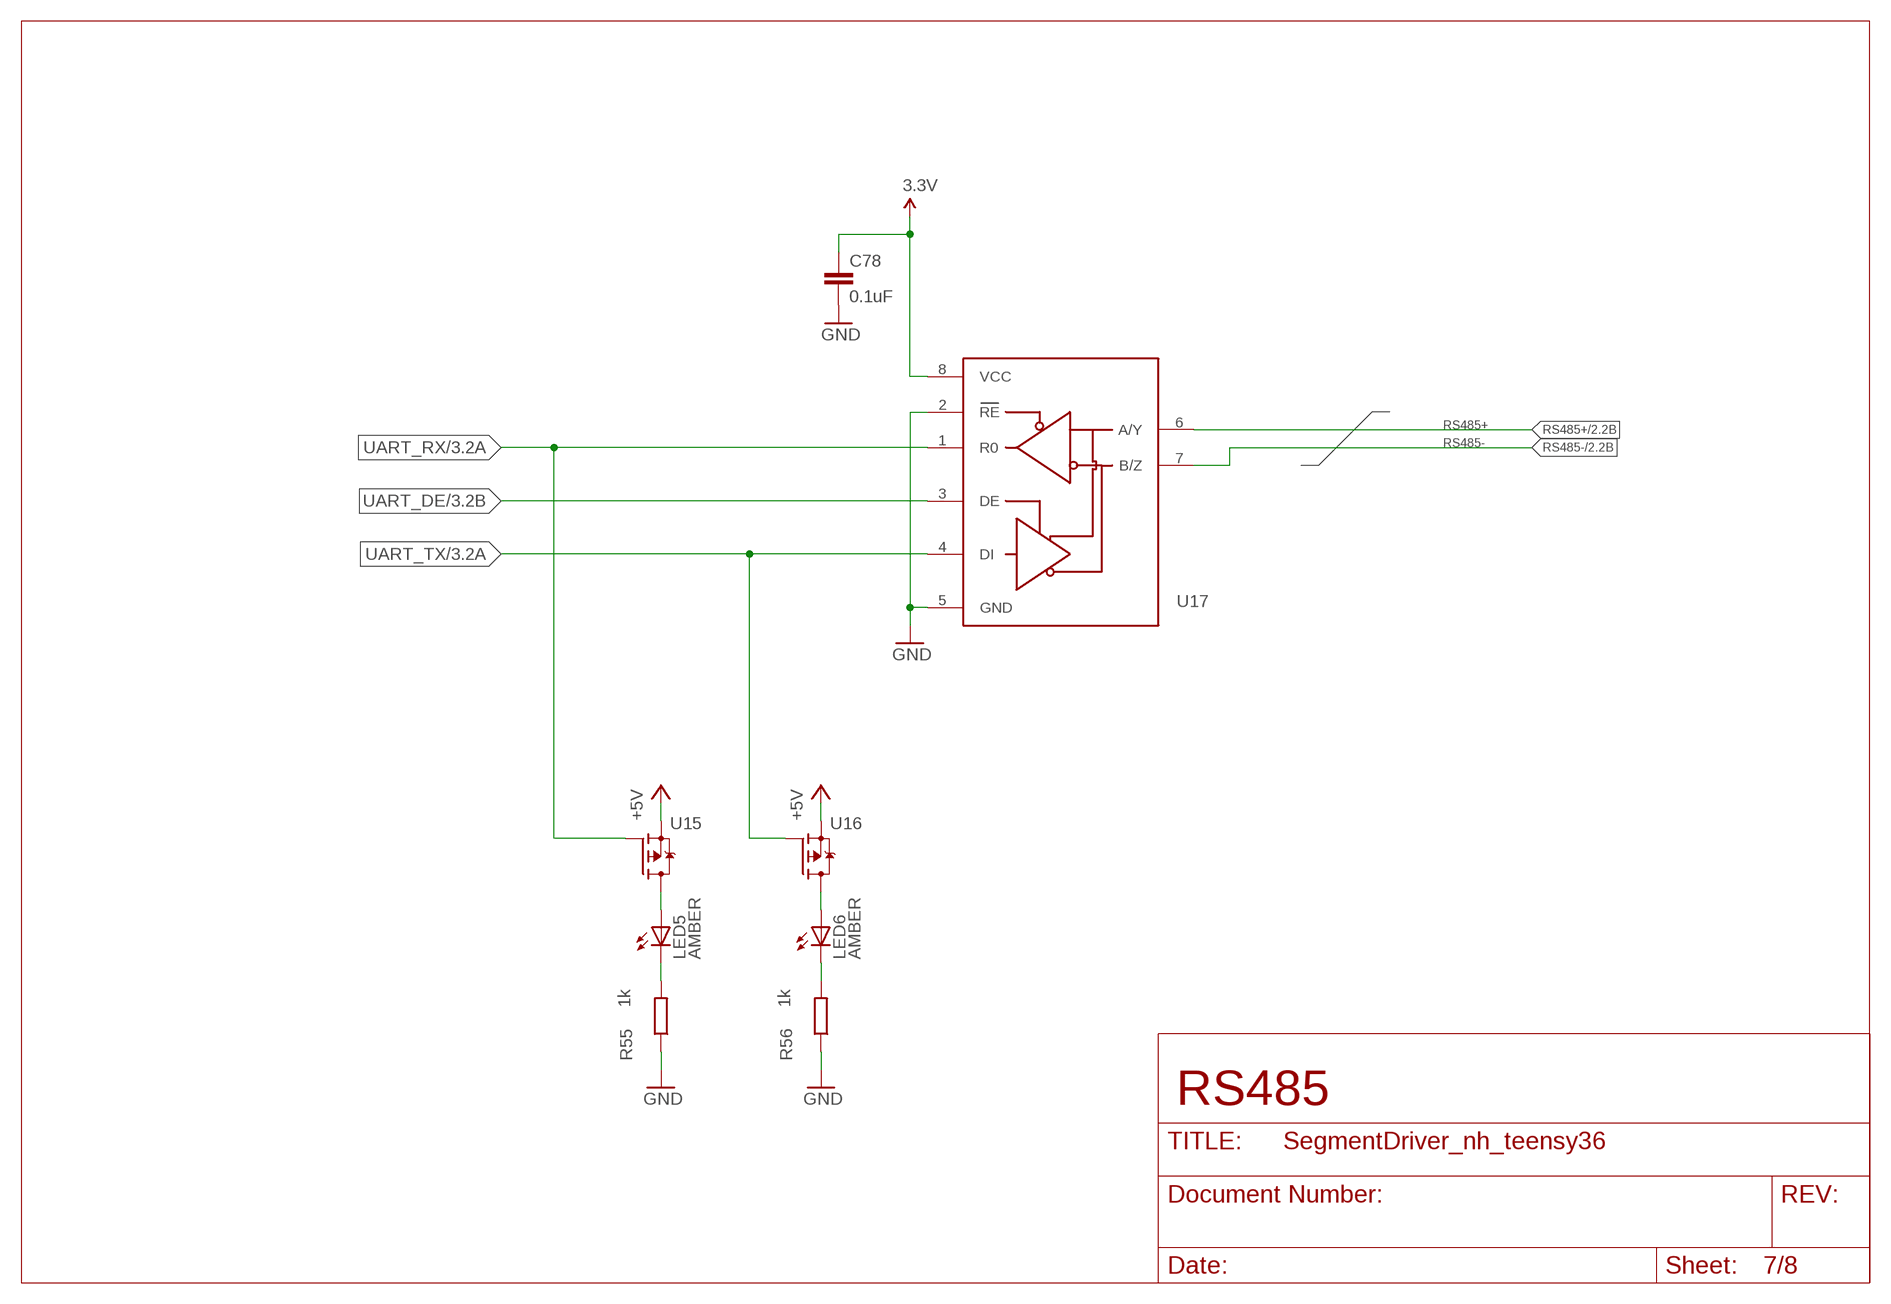
[diagram p6: schematic, sheet 7]

### Parts
C78  0.1uF  C-EUC0603K  [C0603K]
LED5  AMBER  LEDCHIPLED_0603  [CHIPLED_0603]
LED6  AMBER  LEDCHIPLED_0603  [CHIPLED_0603]
R55  1k  R-EU_R0603  [R0603]
R56  1k  R-EU_R0603  [R0603]
U15  DMP2215L-7  [SOT95P240X110-3N]
U16  DMP2215L-7  [SOT95P240X110-3N]
U17  ISL83078E  [SOIC08]

### Nets
3.3V: C78.1 U17.8(VCC) ; also sheet 1,2,4
+5V: U15.2(S) U16.2(S) ; also sheet 1
GND: C78.2 R55.1 R56.1 U17.2(RE) U17.5(GND) ; also sheet 1,2,3,4,5,6,8
N$25: LED5.C R55.2
N$26: LED6.C R56.2
N$60: LED5.A U15.3(D)
N$61: LED6.A U16.3(D)
RS485+: U17.6(A/Y) ; also sheet 2
RS485-: U17.7(B/Z) ; also sheet 2
UART_DE: U17.3(DE) ; also sheet 3
UART_RX: U15.1(G) U17.1(R0) ; also sheet 3
UART_TX: U16.1(G) U17.4(DI) ; also sheet 3

### Notes on the sheet
- RS485

## Sheet 8 of 8
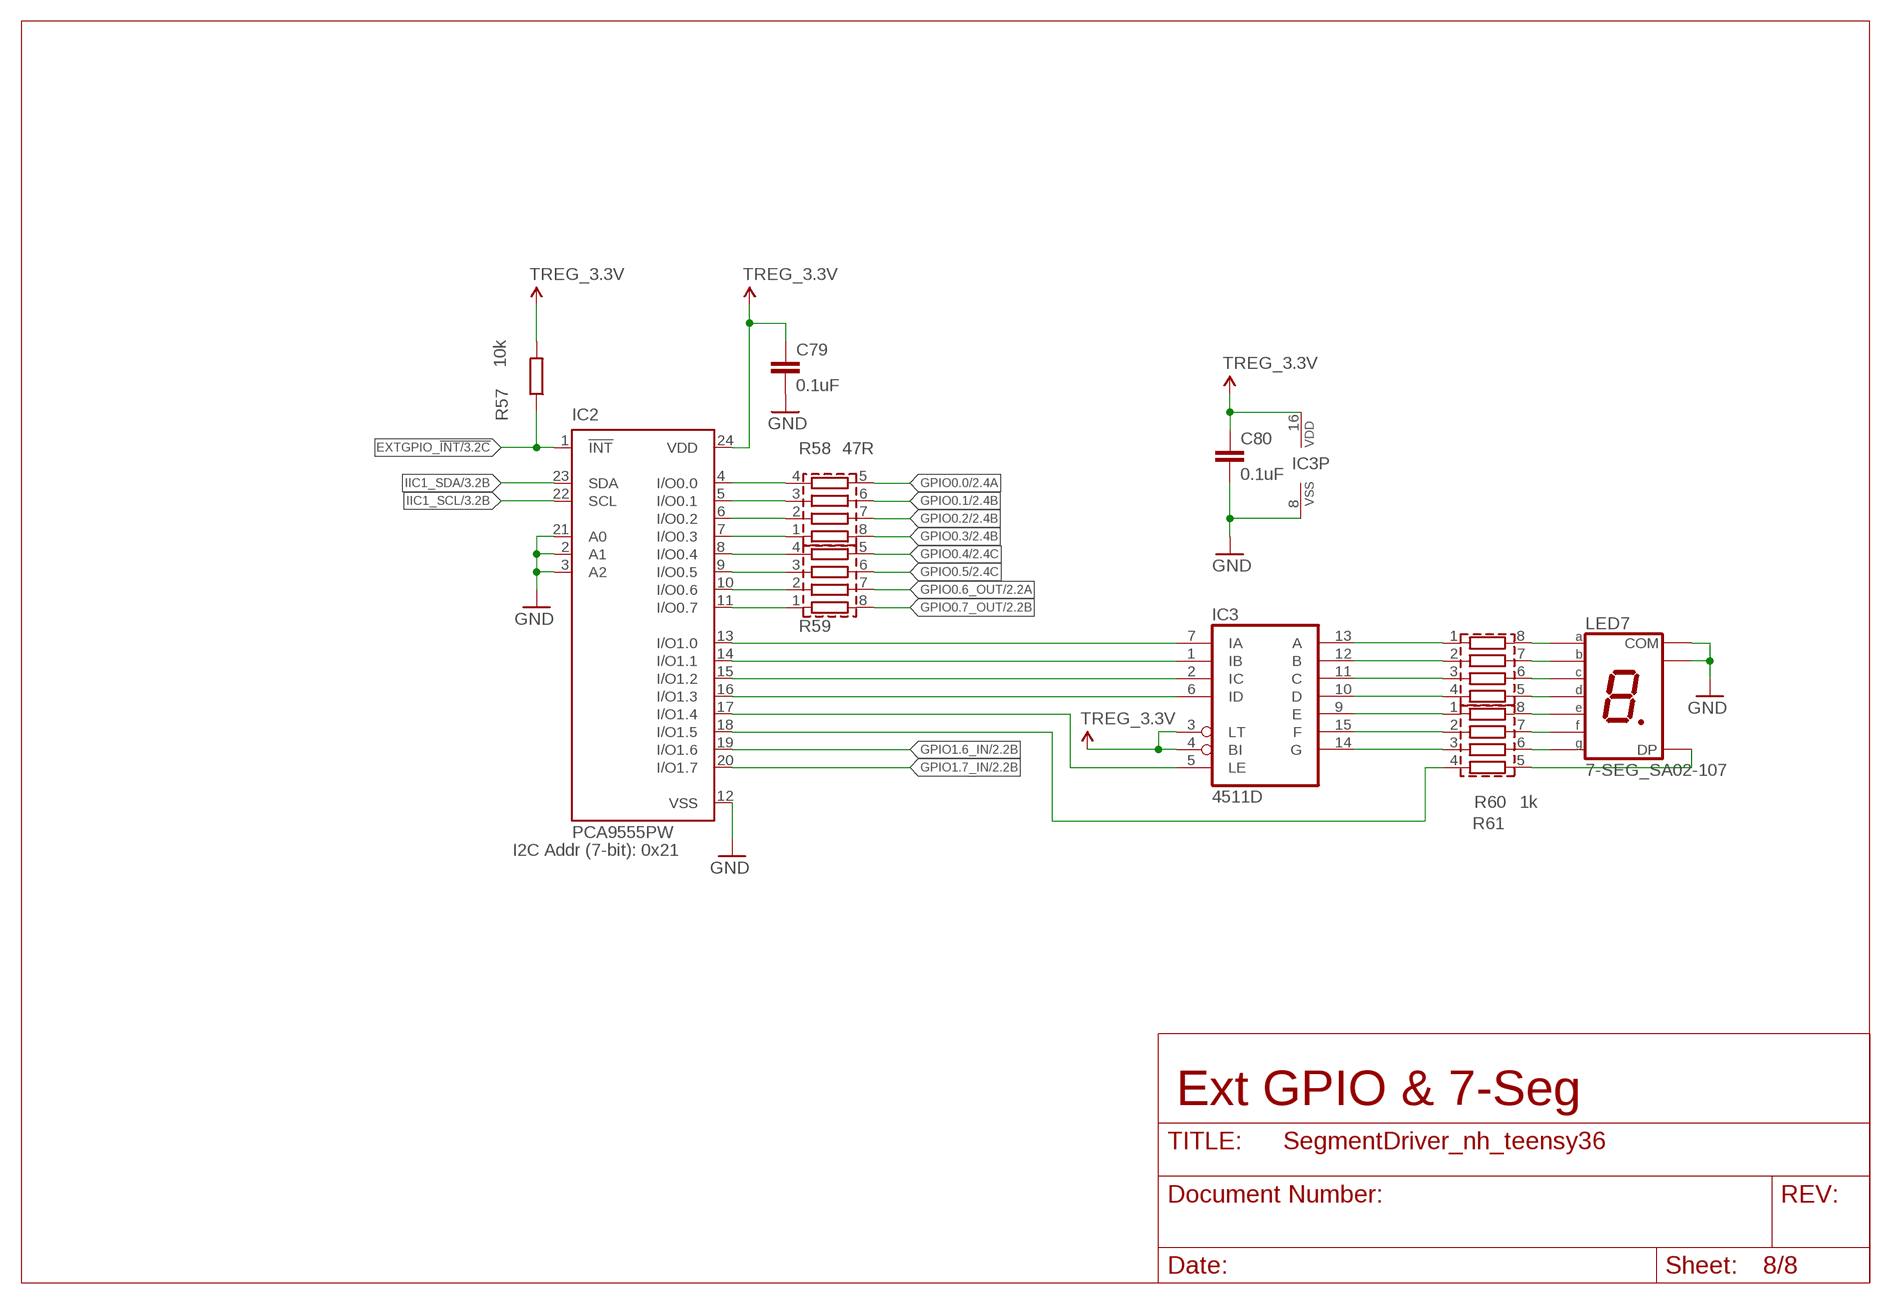
[diagram p7: schematic, sheet 8]

### Parts
C79  0.1uF  C-EUC0603K  [C0603K]
C80  0.1uF  C-EUC0603K  [C0603K]
IC2  PCA9555PW  [TSSOP24]
IC3  4511D  [SO16]
LED7  7-SEG_SA02-107  [SA02107]
R57  10k  R-EU_R0603  [R0603]
R58  47R  EXBV8V330JV  [RESCAV80P320X160X70-8N]
R59  47R  EXBV8V330JV  [RESCAV80P320X160X70-8N]
R60  47R  EXBV8V330JV  [RESCAV80P320X160X70-8N]
R61  1k  EXBV8V330JV  [RESCAV80P320X160X70-8N]

### Nets
EXTGPIO_!INT: IC2.1(!INT) R57.1 ; also sheet 3
GND: C79.2 C80.2 IC2.2(A1) IC2.3(A2) IC2.12(VSS) IC2.21(A0) IC3.8(VSS) LED7.COM@3(COM) LED7.COM@8(COM) ; also sheet 1,2,3,4,5,6,7
GPIO0.0: R58.5 ; also sheet 2
GPIO0.1: R58.6 ; also sheet 2
GPIO0.2: R58.7 ; also sheet 2
GPIO0.3: R58.8 ; also sheet 2
GPIO0.4: R59.5 ; also sheet 2
GPIO0.5: R59.6 ; also sheet 2
GPIO0.6_OUT: R59.7 ; also sheet 2
GPIO0.7_OUT: R59.8 ; also sheet 2
GPIO1.6_IN: IC2.19(I/O1.6) ; also sheet 2
GPIO1.7_IN: IC2.20(I/O1.7) ; also sheet 2
IIC1_SCL: IC2.22(SCL) ; also sheet 3,4
IIC1_SDA: IC2.23(SDA) ; also sheet 3,4
N$30: IC2.4(I/O0.0) R58.4
N$36: IC2.5(I/O0.1) R58.3
N$37: IC2.6(I/O0.2) R58.2
N$38: IC2.7(I/O0.3) R58.1
N$41: IC2.8(I/O0.4) R59.4
N$53: IC2.9(I/O0.5) R59.3
N$54: IC2.10(I/O0.6) R59.2
N$55: IC2.11(I/O0.7) R59.1
N$88: IC2.13(I/O1.0) IC3.7(IA)
N$89: IC3.13(A) R60.1
N$90: IC3.12(B) R60.2
N$91: IC3.11(C) R60.3
N$92: IC3.10(D) R60.4
N$93: IC3.9(E) R61.1
N$94: IC3.15(F) R61.2
N$95: IC3.14(G) R61.3
N$96: LED7.A@7(A) R60.8
N$97: LED7.B@6(B) R60.7
N$98: LED7.C@4(C) R60.6
N$99: LED7.D@2(D) R60.5
N$100: LED7.E@1(E) R61.8
N$101: LED7.F@9(F) R61.7
N$102: LED7.G@10(G) R61.6
N$103: LED7.DP@5(DP) R61.5
N$104: IC2.14(I/O1.1) IC3.1(IB)
N$105: IC2.15(I/O1.2) IC3.2(IC)
N$106: IC2.16(I/O1.3) IC3.6(ID)
N$107: IC2.17(I/O1.4) IC3.5(LE)
N$108: IC2.18(I/O1.5) R61.4
TREG_3.3V: C79.1 C80.1 IC2.24(VDD) IC3.3(LT) IC3.4(BI) IC3.16(VDD) R57.2 ; also sheet 3

### Notes on the sheet
- I2C Addr (7-bit): 0x21
- Ext GPIO & 7-Seg

## Power pins joined to a net without a drawn wire
AREF: U$1.AREF
VUSB: U$1.VUSB
VUSB1: U$1.VUSB1

## Library data of the parts
$2_206_$_2016-11-07_20-18-07 H6 H7 = simbits:MOUNT-HOLE: MOUNTING HOLE with drill center marker
BAT1 = simbits:BATTERY: Battery Holders Various common sizes : AA, AAA, 20mm coin cell and 12mm coin cell. 20MM_4LEGS, BATT-10373; DIGIKEY: BK-912-CT-ND
C1 C2 = Panasonic-EEEFK_EEEFP:EEE-: Aluminum Electrolytic Capacitors,Surface Mount Type; MPN: EEE-FP1V221AP; OC_FARNELL: 1539514; OC_NEWARK: 94M7043; PACKAGE: CASE-F; SUPPLIER: PANASONIC; TOLERANCE: ±20 %; VOLTAGERATING: 35V
C3 C4 C6 C14 C33-C82 C86-C91 = rcl:C-EU: CAPACITOR, European symbol
H1-H5 = simbits:MOUNT-PAD-ROUND: MOUNTING PAD, round
IC2 = micro-philips:PCA9555: 16-bit I2C and SMBus I/O port with interrupt Source: PCA9555_5.pdf; MPN: PCA9555PW; OC_FARNELL: 1408297; OC_NEWARK: 63K6069
IC3 = 45xx:4511: BCD to 7-segment LATCH/DECODER/DRIVER
IC6 = 74xx-little-de:74*1G00: 2-input NAND gate
K1 K2 = Wurth_Elektronik_Electromechanic_Terminal_Blocks_Connectors_rev15d:691322310008: WR-TBL Serie 322 - 3.81mm Vertical PCB Header , 8 Pins=>Code : Con_TBL_Pluggable_3.81_PCB_THT_Simple_691322310008 <http://katalog.we-online.de/media/images/eican/Con_TBL_Pluggable_3.81_PCB_THT_Simple_6913223100xx_pf2.jpg> Details see: http://katalog.we-online.de/en/em/691_322_310_0xx Created 2014-06-19, Karrer Zheng 2014 (C) Würth Elektronik
K3 = Wurth_Elektronik_Electromechanic_Terminal_Blocks_Connectors_rev15d:691322310004: WR-TBL Serie 322 - 3.81mm Vertical PCB Header , 4 Pins=>Code : Con_TBL_Pluggable_3.81_PCB_THT_Simple_691322310004 <http://katalog.we-online.de/media/images/eican/Con_TBL_Pluggable_3.81_PCB_THT_Simple_6913223100xx_pf2.jpg> Details see: http://katalog.we-online.de/en/em/691_322_310_0xx Created 2014-06-19, Karrer Zheng 2014 (C) Würth Elektronik
K4 = Wurth_Elektronik_Electromechanic_Terminal_Blocks_Connectors_rev15d:691322310002: WR-TBL Serie 322 - 3.81mm Vertical PCB Header , 2 Pins=>Code : Con_TBL_Pluggable_3.81_PCB_THT_Simple_691322310002 <http://katalog.we-online.de/media/images/eican/Con_TBL_Pluggable_3.81_PCB_THT_Simple_6913223100xx_pf2.jpg> Details see: http://katalog.we-online.de/en/em/691_322_310_0xx Created 2014-06-19, Karrer Zheng 2014 (C) Würth Elektronik
K5 = Wurth_Elektronik_Electromechanic_Input-Output_Connectors_rev15c:615016149521: WR-MJ_Modular Jack_Tab UP_8P8C_Assembly1x2 8P8C Tab UP_Pre-Assembly 1x2 Details see: Created 2014-10-16, Aslant Tao 2014 (C) Würth Elektronik
K6 K7 = Wurth_Elektronik_Electromechanic_Terminal_Blocks_Connectors_rev15d:691322310003: WR-TBL Serie 322 - 3.81mm Vertical PCB Header , 3 Pins=>Code : Con_TBL_Pluggable_3.81_PCB_THT_Simple_691322310003 <http://katalog.we-online.de/media/images/eican/Con_TBL_Pluggable_3.81_PCB_THT_Simple_6913223100xx_pf2.jpg> Details see: http://katalog.we-online.de/en/em/691_322_310_0xx Created 2014-06-19, Karrer Zheng 2014 (C) Würth Elektronik
K17-K25 = Wurth_Elektronik_Electromechanic_Terminal_Blocks_Connectors_rev15d:691210910004: WR-TBL Serie 2109 - 2.54mm Horizontal Entry Modular with Rising Cage Clamp - 0.8mm2 Wires, 4 Pins=>Code : Con_TBL_Screw_RisingClamp_2.54_691210910004 <http://katalog.we-online.de/media/images/eican/Con_TBL_Screw_RisingClamp_2.54_6912109100xx_pf2.jpg> Details see: http://katalog.we-online.de/en/em/691_210_910_0xx Created 2014-06-18, Karrer Zheng 2014 (C) Würth Elektronik
LED2 LED5 LED6 = adafruit:LED: LED OSRAM: - CHIPLED LG R971, LG N971, LY N971, LG Q971, LY Q971, LO R971, LY R971 LH N974, LH R974 LS Q976, LO Q976, LY Q976 LO Q996 - Hyper CHIPLED LW Q18S LB Q993, LB Q99A, LB R99A - SideLED LS A670, LO A670, LY A670, LG A670, LP A670 LB A673, LV A673, LT A673, LW A673 LH A674 LY A675 LS A676, LA A676, LO A676, LY A676, LW A676 LS A679, LY A679, LG A679 - Hyper Micro SIDELED® LS Y876, LA Y876, LO Y876, LY Y876 LT Y87S - SmartLED LW L88C, LW L88S LB L89C, LB L89S, LG L890 LS L89K, LO L89K, LY L89K LS L896, LA L896, LO L896, LY L896 - TOPLED LS T670, LO T670, LY T670, LG T670, LP T670 LSG T670, LSP T670, LSY T670, LOP T670, LYG T670 LG T671, LOG T671, LSG T671 LB T673, LV T673, LT T673, LW T673 LH T674 LS T676, LA T676, LO T676, LY T676, LB T676, LH T676, LSB T676, LW T676 LB T67C, LV T67C, LT T67C, LS T67K, LO T67K, LY T67K, LW E67C LS E67B, LA E67B, LO E67B, LY E67B, LB E67C, LV E67C, LT E67C LW T67C LS T679, LY T679, LG T679 LS T770, LO T770, LY T770, LG T770, LP T770 LB T773, LV T773, LT T773, LW T773 LH T774 LS E675, LA E675, LY E675, LS T675 LS T776, LA T776, LO T776, LY T776, LB T776 LHGB T686 LT T68C, LB T68C - Hyper Mini TOPLED® LB M676 - Mini TOPLED Santana® LG M470 LS M47K, LO M47K, LY M47K Source: http://www.osram.convergy.de/
LED7 = display-kingbright-2:7-SEG_: Kingbright 14.2mm (0.56 INCH) SINGLE DIGIT NUMERIC DUISPLAY Source: SA56-11EWA(Ver1189471036.pdf
R1 R2 R4-R6 R9 R19-R21 R28-R57 R62-R72 R74-R89 = rcl:R-EU_: RESISTOR, European symbol
R22-R27 = simbits:EXBV8V: Chip Resistor Array; MPN: EXBV8V470JV; OC_FARNELL: 2060153; OC_NEWARK: 65T9009; PACKAGE: 0603; POWERRATING: 0.063 W/element; SUPPLIER: PANASONIC; TOLERANCE: ±5 %
R58 R59 = simbits:EXBV8V: Chip Resistor Array; MPN: EXBV8V470JV; OC_FARNELL: 2060153; OC_NEWARK: 65T9009; PACKAGE: 0603; POWERRATING: 0.063 W/element; SUPPLIER: PANASONIC; TOLERANCE: ±5 %; VALUE: 33R
R60 R61 = simbits:EXBV8V: Chip Resistor Array; MPN: EXBV8V102JV; OC_FARNELL: 2060153; OC_NEWARK: 65T9009; PACKAGE: 0603; POWERRATING: 0.063 W/element; SUPPLIER: PANASONIC; TOLERANCE: ±5 %; VALUE: 33R
S1 = EAGLE-TACT_SWITCHES-rev1:418127270902: WS-DITV THT version, raise actuator without top tape sealed Specification Contact Rating Switching :25mA, 24VDC Non-Switching : 100mA, 50VDC Contact Resistance Initial: 50mΩ max. After life test: 100mΩ max. Insulation Resistance: min.100MΩ at 500VDC Dielectric Strength : 500VAC for 1 minute Operation Force :600g max. Mechanical Life : 2000 cycles Electrical Life : 2000 cycles / 25mA, 24VDC Raise Actuator type Material Cover : : PA9T UL 94 V-0, color Black Base :PA9T UL 94 V-0, color Black. Actuator :PA46 UL 94 V-0, color White Contact : : Gold Plated Terminal : Gold Plated <http://katalog.we-online.de/media/images/v2/Family_WS_IC_4181272709xx_pf2.jpg> Details see: http://katalog.we-online.de/en/em/418_127_270_9xx?sid=338a3ff20b 2015 (C) Würth Elektronik
S2 S3 = switch:TL36WO: TINY SWITCH ON - ON Source: http://www2.produktinfo.conrad.com/datenblaetter/700000-724999/705152-da-01-de-Subminiaturschalter_TL_36WO.pdf
SW1-SW7 = simbits:434153017835: WS-TASV Tact Switch J-Bend SMD version Specification Rating : 50mA, 12VDC Contact Resistance Initial: 100mΩ max. After life test:1mΩ max. Insulation Resistance: min.100MΩ at 500VDC Dielectric Strength : 250VAC for 1 minute Stroke:0.15±0.1mm Bounce :10ms max. Material Cover : : Stainless steel Stem :LCP UL 94 V-0. FramePA46 UL HB, color Black >Contact : Stainless Steel with Silver Tape:Polyimide tape Terminal : Copper Alloy with Silver <http://katalog.we-online.de/media/images/v2/WS-TASU_434331013822_a_4C.jpg> Details see: http://katalog.we-online.de/en/em/TASV_3_5X2_9_SMD_J-BEND?sid=d553d9ab8e 2015 (C) Würth Elektronik
U1 U20 = simbits:78XX; FARNELL_OC: 1696320
U2 = adafruit:PCA9685: PCA9685 - 16 Channel 12-Bit I2C PWM Controller 5.0V tolerant 16 channel, 12-bit I2C PWM controller with 25mA per output (max. 400mA total) Digikey: 568-5931-1-ND
U12-U14 = simbits:ADS1X48: ADS1X48 Analog-To-Digital converter with programmable gain amplifier (PGA) for sensor measurment ADS1148IPW 16bit TTSOP28 ADS1148IRHB 16bit VQFN32 ADS1248IPW 24bit TTSOP28 datasheet: http://www.ti.com/lit/ds/symlink/ads1248.pdf
U15 U16 = simbits:DMP2215L-7: P-CHANNEL ENHANCEMENT MODE FIELD EFFECT TRANSISTOR; MPN: DMP2215L-7; OC_FARNELL: 1713864; OC_NEWARK: 25R4539; PACKAGE: SOT-23-3; SUPPLIER: Diodes Inc
U17 = LINE_DRIVERS:ISL83078E
U19 = simbits:ADP3333: ADP3333 High Accuracy Ultralow IQ, 300 mA, anyCAP Low Dropout Regulator Datasheet: http://www.mouser.com/ds/2/609/ADP3333-878831.pdf; MOUSER_OC: 584-ADP3333ARMZ-5-R7
U$1 = Teensy_3_and_LC_Series_Boards_v1.4:TEENSY_3.6_ALL_PINS: All PIN version of the Teensy 3.6.
X1-X6 = con-molex:53?-03: CONNECTOR wire to board 1.25 mm (.049 inch) pitch header; MF: MOLEX; MPN: 53261-0390; OC_FARNELL: 1125359; OC_NEWARK: 57H5006

## Net classes
2 PWR: drill 0.4 mm

## Board
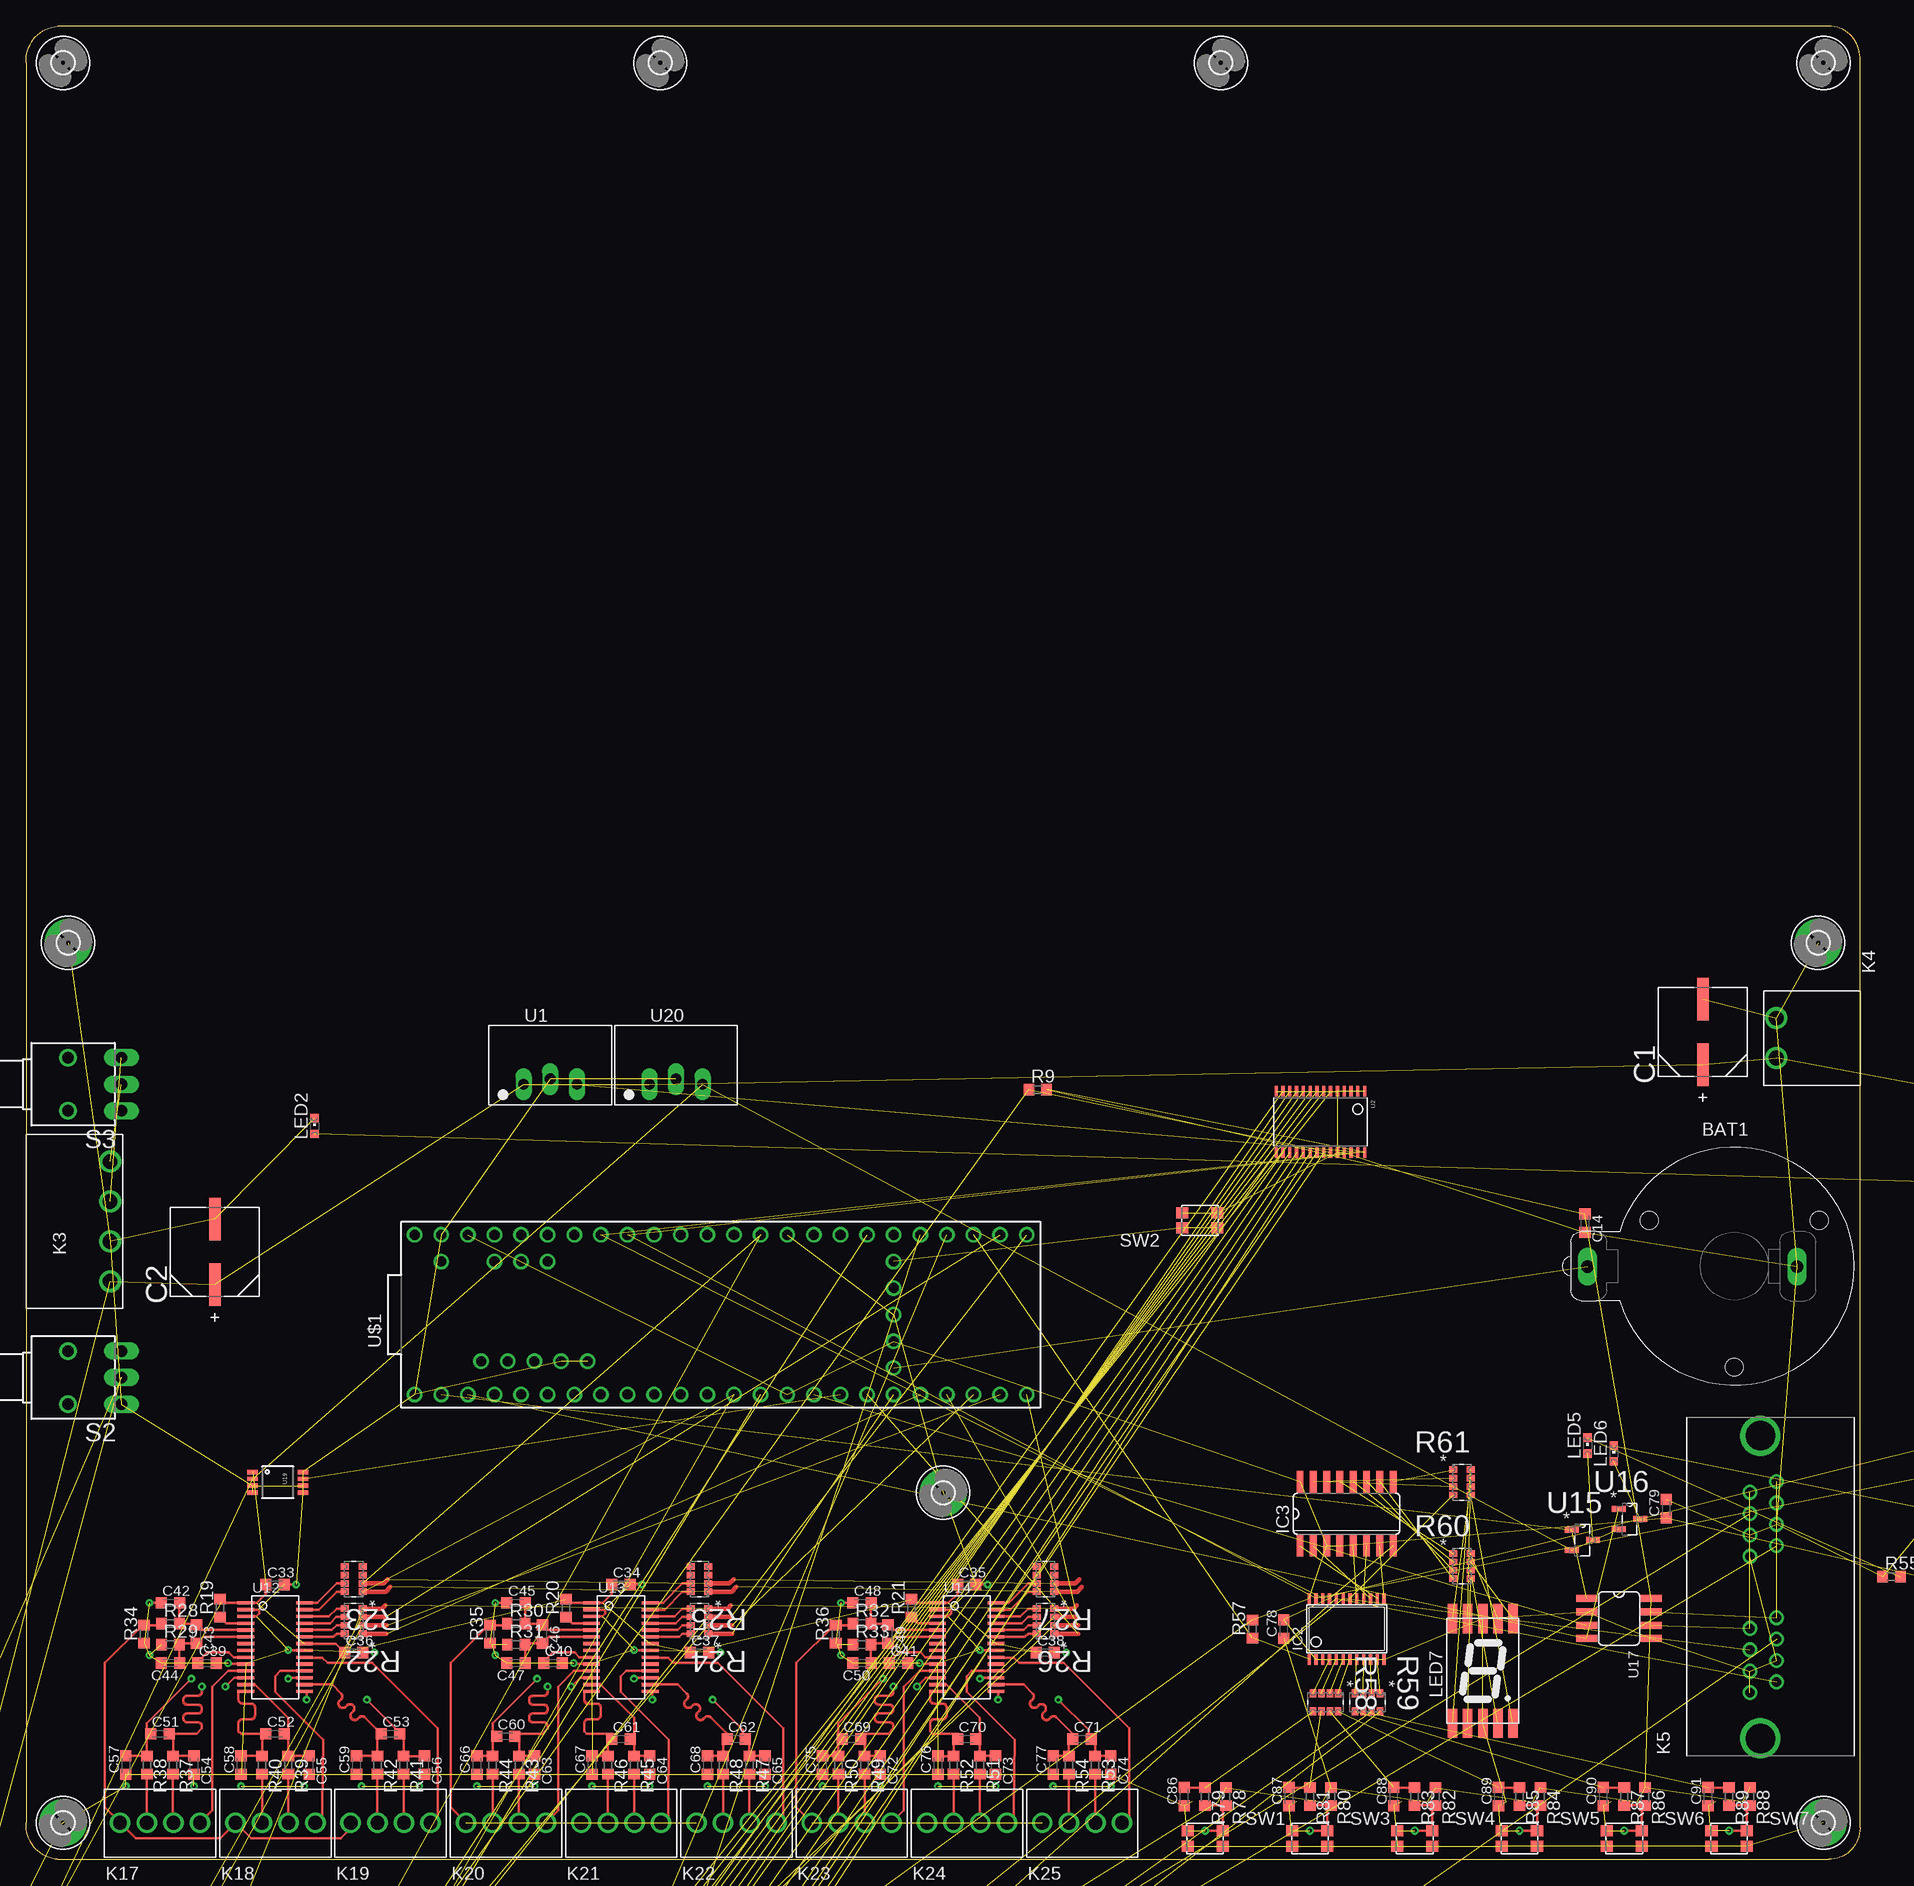
[diagram p8: board, top side]
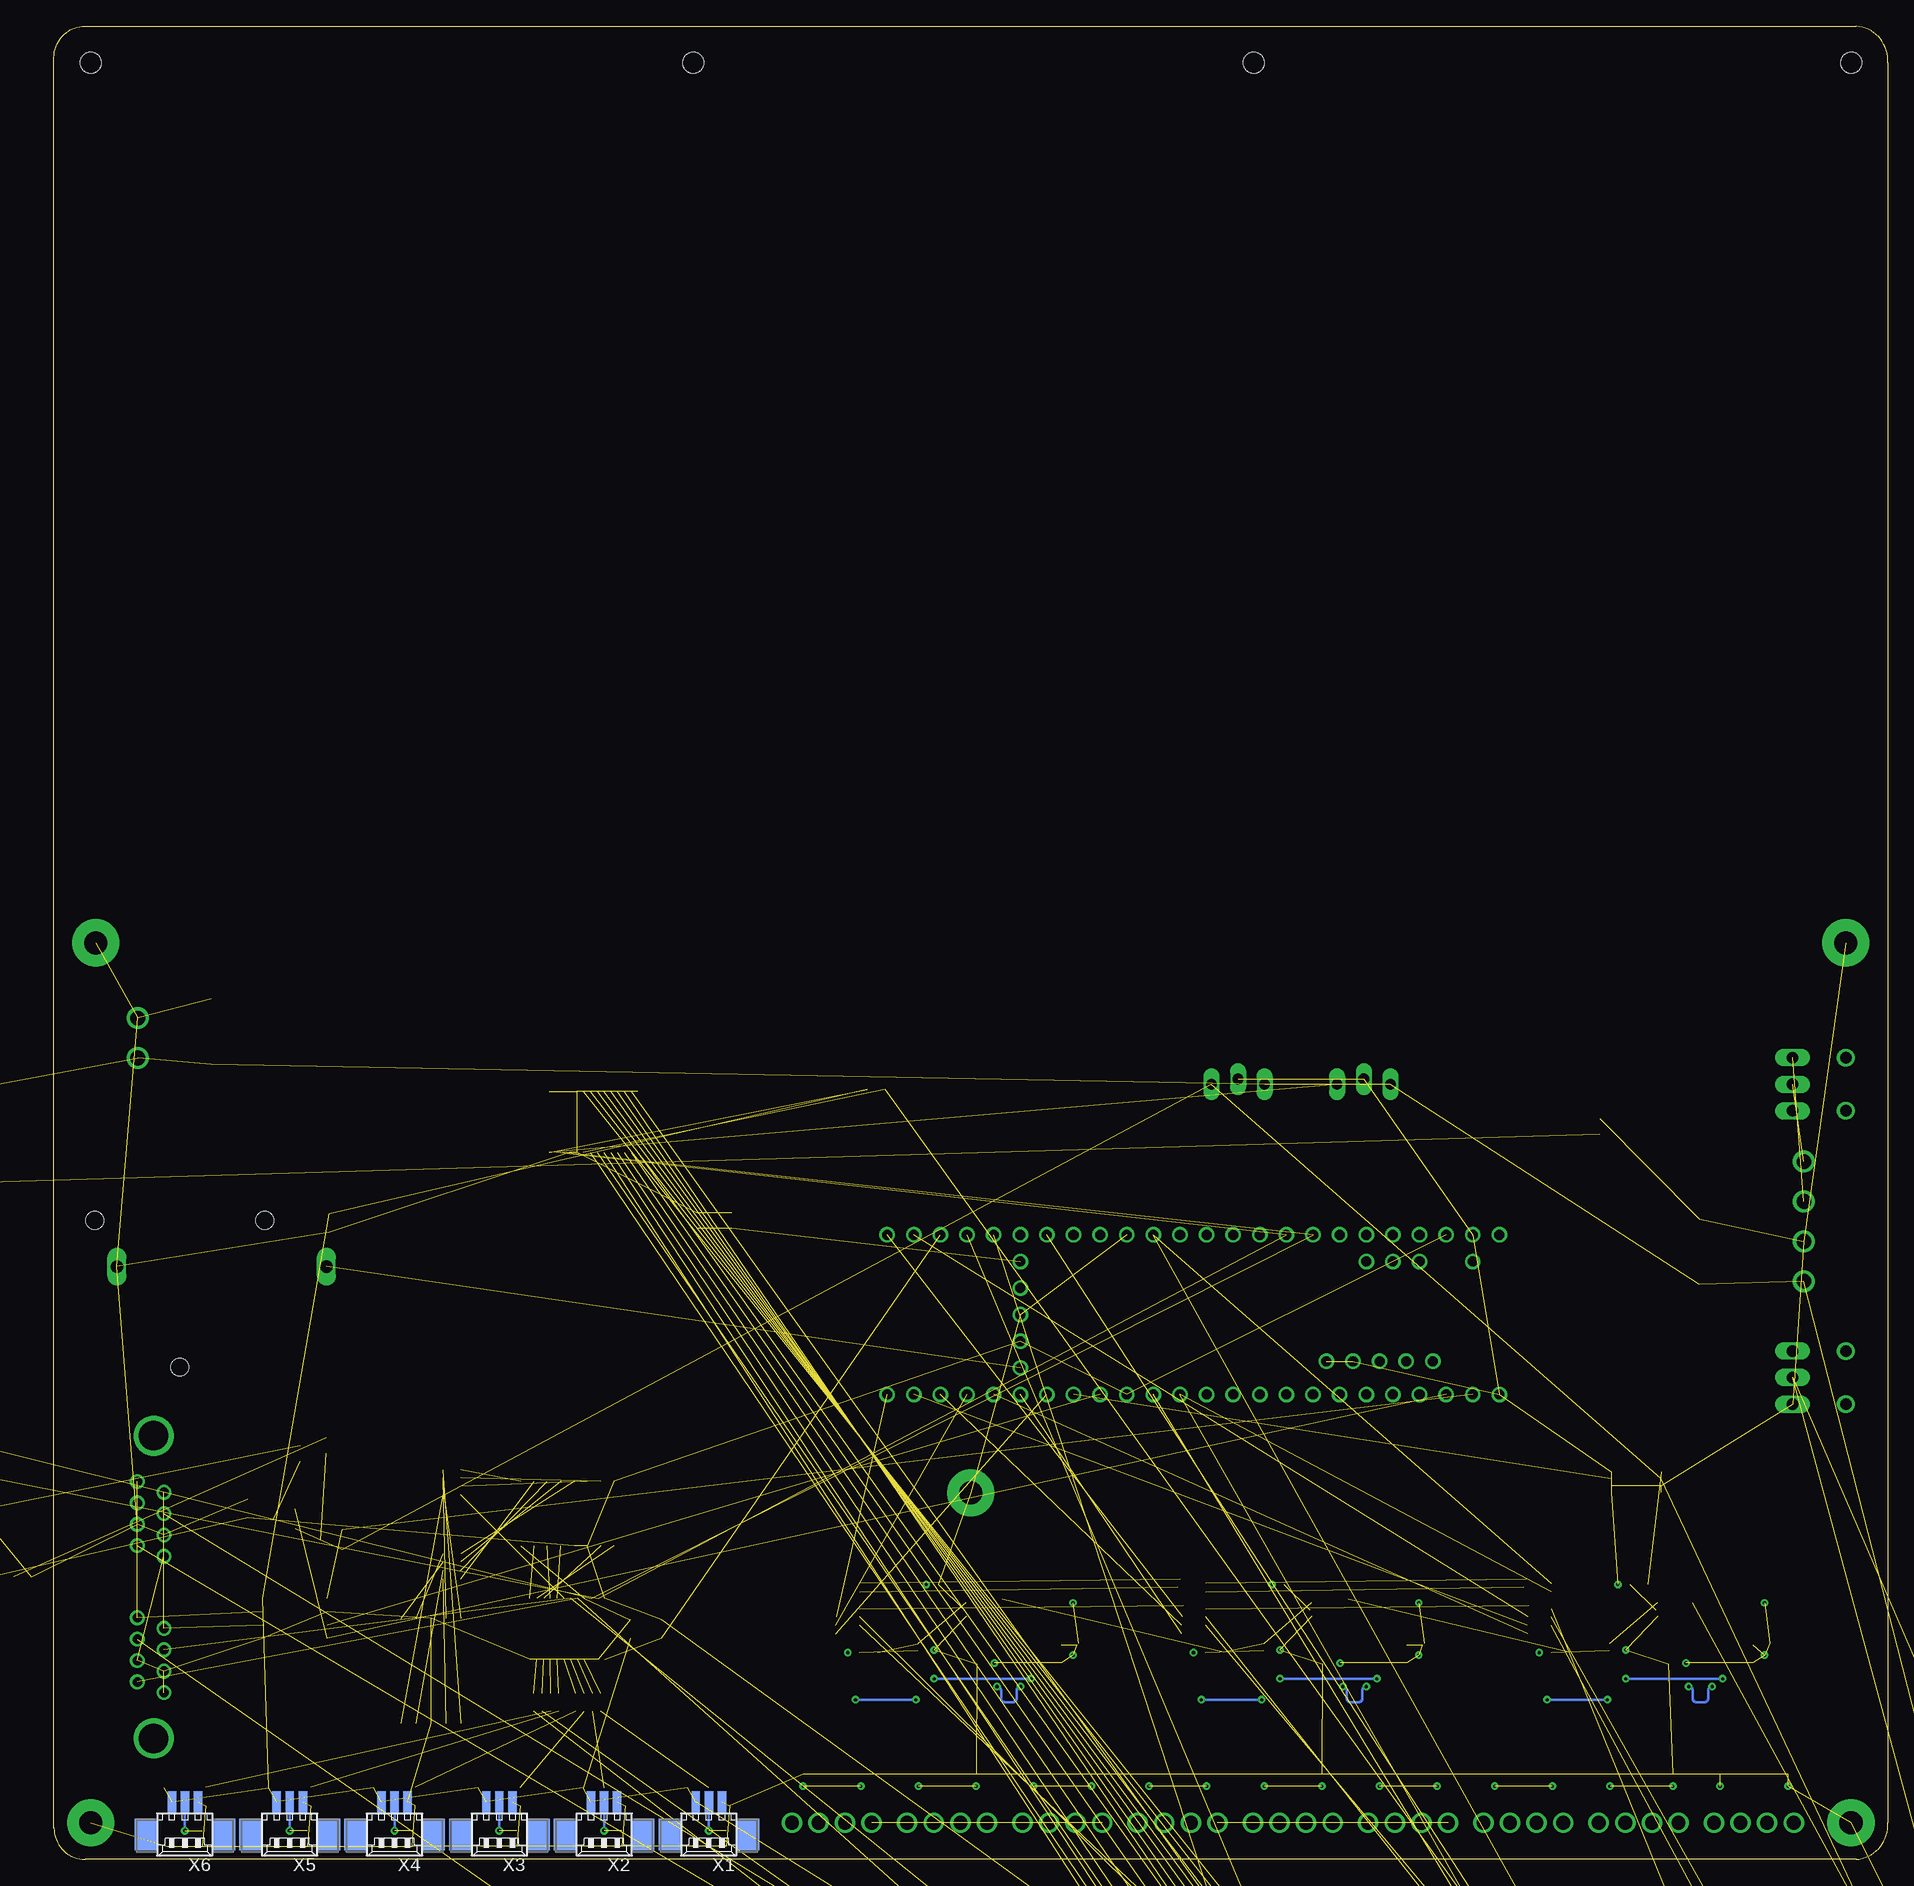
[diagram p9: board, bottom side, seen from below]

Size 175.01 x 175 mm. Coordinates in mm from the lower left corner, seen from the top.
Outline: 3.01,0 172.01,0 arc90 175.01,3 175.01,172 arc90 172.01,175 3.01,175 arc90 0.01,171.5 0.01,3.5 arc90 3.01,0
Copper layers (1*16): Top 0.035mm / dielectric 1.5mm / Bottom 0.035mm
Design rules "default": minimum track width 10mil, minimum drill 0.6mm, track to track 8mil, track to pad 8mil, pad to pad 8mil, via to via 8mil, smd to smd 8mil, copper to edge 40mil, drill to drill 8mil, minimum pad ring 10mil, minimum via ring 8mil, stop-mask expansion 4mil, vias tented up to drill 0mil, thermal gap 10mil

### Footprints (pad centres in the part's own frame; a part is rotated, then mirrored left to right if it is on the bottom)
2,0 = hole 2: 0,0
79528211 = drill 1.2 long: + -14,0; - 6,0 | hole 1.7: 0,-9.6; -8.1,4.4; 8.1,4.4
CAPAE830X1050N = smd 4.064 x 1.092: 1 -3.124,0; 2 3.124,0
C0603K = smd 1.05 x 1.08: 1 -0.875,0; 2 0.875,0
C0805K = smd 1.3 x 1.6: 1 -1,0; 2 1,0
2,0-PAD = drill 2.2 pad 4.5: B2,2 0,0
TSSOP24 = smd 0.305 x 0.991: 1 -3.575,-2.918; 2 -2.925,-2.918; 3 -2.275,-2.918; 4 -1.625,-2.918; 5 -0.975,-2.918; 6 -0.325,-2.918; 7 0.325,-2.918; 8 0.975,-2.918; 9 1.625,-2.918; 10 2.275,-2.918; 11 2.925,-2.918; 12 3.575,-2.918; 13 3.575,2.918; 14 2.925,2.918; 15 2.275,2.918; 16 1.625,2.918; 17 0.975,2.918; 18 0.325,2.918; 19 -0.325,2.918; 20 -0.975,2.918; 21 -1.625,2.918; 22 -2.275,2.918; 23 -2.925,2.918; 24 -3.575,2.918
SO16 = smd 0.66 x 2.032: 1 -4.445,-3.073; 2 -3.175,-3.073; 3 -1.905,-3.073; 4 -0.635,-3.073; 5 0.635,-3.073; 6 1.905,-3.073; 7 3.175,-3.073; 8 4.445,-3.073; 9 4.445,3.073; 10 3.175,3.073; 11 1.905,3.073; 12 0.635,3.073; 13 -0.635,3.073; 14 -1.905,3.073; 15 -3.175,3.073; 16 -4.445,3.073
SC70-5 = smd 0.4 x 0.7: 1 -0.65,-0.85; 2 0,-0.85; 3 0.65,-0.85; 4 0.65,0.85; 5 -0.65,0.85
691322310008 = drill 1.4: 1 -15.24,0; 2 -11.43,0; 3 -7.62,0; 4 -3.81,0; 5 0,0; 6 3.81,0; 7 7.62,0; 8 11.43,0
691322310004 = drill 1.4: 1 -3.81,0; 2 0,0; 3 3.81,0; 4 7.62,0
691322310002 = drill 1.4: 1 -3.81,0; 2 0,0
615016149521 = drill 0.9: A1 -2.93,-1.54; A2 -3.95,1; A3 -4.97,-1.54; A4 -5.99,1; A5 -7.01,-1.54; A6 -8.03,1; A7 -9.05,-1.54; A8 -10.07,1; B1 10.07,-1.54; B2 9.05,1; B3 8.03,-1.54; B4 7.01,1; B5 5.99,-1.54; B6 4.97,1; B7 3.95,-1.54; B8 2.93,1 | drill 2.8: Z1 -14.45,0; Z2 14.45,0
691322310003 = drill 1.4: 1 -3.81,0; 2 0,0; 3 3.81,0
691210910004 = drill 1.3: 1 -2.54,0; 2 0,0; 3 2.54,0; 4 5.08,0
CHIPLED_0603 = smd 0.8 x 0.8: A 0,-0.75; C 0,0.75
SA02107 = smd 0.9 x 2.8: A@7 1.44,5; B@6 2.88,5; C@4 1.44,-5; COM@3 0,-5; COM@8 0,5; D@2 -1.44,-5; DP@5 2.88,-5; E@1 -2.88,-5; F@9 -1.44,5; G@10 -2.88,5
R0603 = smd 1 x 1.1: 1 -0.85,0; 2 0.85,0
RESCAV80P320X160X70-8N = smd 0.762 x 0.61: 1 -0.838,1.194; 2 -0.838,0.406; 3 -0.838,-0.406; 4 -0.838,-1.194; 5 0.838,-1.194; 6 0.838,-0.406; 7 0.838,0.406; 8 0.838,1.194
418127270902 = drill 0.8: 1 -1.27,-3.81; 2 1.27,-3.81; A1 -1.27,3.81; A2 1.27,3.81
TL3XWO = drill 1.1 pad 1.422 long: 1 -2.54,-5.08; 2 0,-5.08; 3 2.54,-5.08 | drill 1.1 pad 1.676: M1 -2.54,0; M2 2.54,0
434153017835 = smd 1.15 x 1.05: 1 -1.675,0.725; 2 -1.675,-0.725; 3 1.675,0.725; 4 1.675,-0.725
TO220V_TR1 = drill 1.016 long: 1 -2.54,0; 2 0,0.5; 3 2.54,0
TSSOP28 = smd 0.305 x 0.991: 1 -4.225,-2.918; 2 -3.575,-2.918; 3 -2.925,-2.918; 4 -2.275,-2.918; 5 -1.625,-2.918; 6 -0.975,-2.918; 7 -0.325,-2.918; 8 0.325,-2.918; 9 0.975,-2.918; 10 1.625,-2.918; 11 2.275,-2.918; 12 2.925,-2.918; 13 3.575,-2.918; 14 4.225,-2.918; 15 4.225,2.918; 16 3.575,2.918; 17 2.925,2.918; 18 2.275,2.918; 19 1.625,2.918; 20 0.975,2.918; 21 0.325,2.918; 22 -0.325,2.918; 23 -0.975,2.918; 24 -1.625,2.918; 25 -2.275,2.918; 26 -2.925,2.918; 27 -3.575,2.918; 28 -4.225,2.918
TSSOP28' = smd 0.3 x 1.6: 1 -4.25,-2.8; 2 -3.6,-2.8; 3 -2.95,-2.8; 4 -2.3,-2.8; 5 -1.65,-2.8; 6 -1,-2.8; 7 -0.35,-2.8; 8 0.3,-2.8; 9 0.95,-2.8; 10 1.6,-2.8; 11 2.25,-2.8; 12 2.9,-2.8; 13 3.55,-2.8; 14 4.2,-2.8; 15 4.2,2.8; 16 3.55,2.8; 17 2.9,2.8; 18 2.25,2.8; 19 1.6,2.8; 20 0.95,2.8; 21 0.3,2.8; 22 -0.35,2.8; 23 -1,2.8; 24 -1.65,2.8; 25 -2.3,2.8; 26 -2.95,2.8; 27 -3.6,2.8; 28 -4.25,2.8
SOT95P240X110-3N = smd 1.321 x 0.559: 1 -1.016,0.965; 2 -1.016,-0.965; 3 1.016,0
SOIC08 = smd 0.66 x 2.032: 1 -1.905,-3.073; 2 -0.635,-3.073; 3 0.635,-3.073; 4 1.905,-3.073; 5 1.905,3.073; 6 0.635,3.073; 7 -0.635,3.073; 8 -1.905,3.073
MSOP-8 = smd 0.41 x 1.02: 1 -0.975,-2.4; 2 -0.325,-2.4; 3 0.325,-2.4; 4 0.975,-2.4; 5 0.975,2.4; 6 0.325,2.4; 7 -0.325,2.4; 8 -0.975,2.4
TEENSY_3.6_ALL_PINS = drill 0.965: 0 -7.62,25.4; 1 -7.62,22.86; 2 -7.62,20.32; 3 -7.62,17.78; 3.3V 7.62,22.86; 3.3V3 -7.62,-7.62; 3.3V4 -2.54,-17.78; 4 -7.62,15.24; 5 -7.62,12.7; 6 -7.62,10.16; 7 -7.62,7.62; 8 -7.62,5.08; 9 -7.62,2.54; 10 -7.62,0; 11 -7.62,-2.54; 12 -7.62,-5.08; 13 7.62,-5.08; 14/A0 7.62,-2.54; 15/A1 7.62,0; 16/A2 7.62,2.54; 17/A3 7.62,5.08; 18/A4 7.62,7.62; 19/A5 7.62,10.16; 20/A6 7.62,12.7; 21/A7 7.62,15.24; 22/A8 7.62,17.78; 23/A9 7.62,20.32; 24 -7.62,-10.16; 25 -7.62,-12.7; 26 -7.62,-15.24; 27 -7.62,-17.78; 28 -7.62,-20.32; 29 -7.62,-22.86; 30 -7.62,-25.4; 31/A12 -7.62,-27.94; 32/A13 -7.62,-30.48; 33/A14 7.62,-30.48; 34/A15 7.62,-27.94; 35/A16 7.62,-25.4; 36/A17 7.62,-22.86; 37/A18 7.62,-20.32; 38/A19 7.62,-17.78; 39/A20 7.62,-15.24; A10 5.08,17.78; A11 5.08,15.24; A21 7.62,-12.7; A22 7.62,-10.16; AGND 7.62,25.4; AREF 5.08,20.32; D+ -4.445,16.51; D- -4.445,19.05; GND -7.62,27.94; GND1 7.62,-7.62; GND3 -4.445,13.97; GND4 -4.445,11.43; GND6 0,-17.78; PGM 2.54,-17.78; RESET 5.08,-17.78; VBAT -5.08,-17.78; VIN 7.62,27.94; VUSB 5.08,25.4; VUSB1 -4.445,21.59
53261-03 = smd 0.8 x 2: 1 1.25,-2.5; 2 0,-2.5; 3 -1.25,-2.5 | smd 2.1 x 3: S1 3.75,0.625; S2 -3.75,0.625

### Placement (x,y rotation side)
$2_206_$_2016-11-07_20-18-07  3.51,171.5 0 top
BAT1  163.01,56.6 0 top
C1  160.01,79 90 top
C2  18.01,58 90 top
C3  -37.99,-114 0 top  (outside the outline)
C4  -37.99,-136 0 top  (outside the outline)
C6  250.51,61.5 0 top  (outside the outline)
C14  148.76,60.75 270 top
C33  23.76,26.25 0 top
C34  56.76,26.25 0 top
C35  89.76,26.25 0 top
C36  31.26,19.75 0 top
C37  64.26,19.75 0 top
C38  97.26,19.75 0 top
C39  17.26,18.75 0 top
C40  50.26,18.75 0 top
C41  83.26,18.75 0 top
C42  13.76,24.5 0 top
C43  16.26,21.5 270 top
C44  13.76,18.75 180 top
C45  46.76,24.5 0 top
C46  49.26,21.5 270 top
C47  46.76,18.75 180 top
C48  79.76,24.5 0 top
C49  82.26,21.5 270 top
C50  79.76,18.75 180 top
C51  12.76,12 0 top
C52  23.76,12 0 top
C53  34.76,12 0 top
C54  16.01,9 270 top
C55  27.01,9 270 top
C56  38.01,9 270 top
C57  9.51,9 90 top
C58  20.51,9 90 top
C59  31.51,9 90 top
C60  45.76,11.75 0 top
C61  56.76,11.5 0 top
C62  67.76,11.5 0 top
C63  48.51,9 270 top
C64  59.51,9 270 top
C65  70.51,9 270 top
C66  43.01,9 90 top
C67  54.01,9 90 top
C68  65.01,9 90 top
C69  78.76,11.5 0 top
C70  89.76,11.5 0 top
C71  100.76,11.5 0 top
C72  81.51,9 270 top
C73  92.51,9 270 top
C74  103.51,9 270 top
C75  76.01,9 90 top
C76  87.01,9 90 top
C77  98.01,9 90 top
C78  120.01,22 90 top
C79  156.51,33.5 90 top
C80  186.01,26 0 top  (outside the outline)
C81  -18.99,-43 0 top  (outside the outline)
C82  -18.99,-48 0 top  (outside the outline)
C86  110.51,6 90 top
C87  120.51,6 90 top
C88  130.51,6 90 top
C89  140.51,6 90 top
C90  150.51,6 90 top
C91  160.51,6 90 top
H1  87.51,35 0 top
H2  171.51,3.5 0 top
H3  3.51,3.5 0 top
H4  171.01,87.5 0 top
H5  4.01,87.5 0 top
H6  171.51,171.5 0 top
H7  60.51,171.5 0 top
H8  MOUNT-HOLE2.0  [2,0]  114.01,171.5 0 top
IC2  126.01,22 0 top
IC3  126.01,33 0 top
IC6  -35.99,-120 0 top  (outside the outline)
K1  -45.99,-154 0 top  (outside the outline)
K2  -45.99,-175 0 top  (outside the outline)
K3  8.01,59 90 top
K4  167.01,76.5 270 top
K5  165.51,26 90 top
K6  -57.99,-196 0 top  (outside the outline)
K7  -57.99,-217 0 top  (outside the outline)
K17  11.51,3.5 0 top
K18  22.51,3.5 0 top
K19  33.51,3.5 0 top
K20  44.51,3.5 0 top
K21  55.51,3.5 0 top
K22  66.51,3.5 0 top
K23  77.51,3.5 0 top
K24  88.51,3.5 0 top
K25  99.51,3.5 0 top
LED2  27.51,70 0 top
LED5  149.01,39.5 0 top
LED6  151.51,38.75 0 top
LED7  139.01,18 0 top
R1  -37.99,-126 0 top  (outside the outline)
R2  238.51,63 0 top  (outside the outline)
R4  -70.99,-141 0 top  (outside the outline)
R5  245.01,50 90 top  (outside the outline)
R6  245.01,56 90 top  (outside the outline)
R9  96.53,73.49 0 top
R19  18.51,24 90 top
R20  51.51,24 90 top
R21  84.51,24 90 top
R22  31.26,22.75 180 top
R23  31.26,26.75 180 top
R24  64.26,22.75 180 top
R25  64.26,26.75 180 top
R26  97.26,22.75 180 top
R27  97.26,26.75 180 top
R28  13.76,22.5 0 top
R29  13.76,20.5 0 top
R30  46.76,22.5 0 top
R31  46.76,20.5 0 top
R32  79.76,22.5 0 top
R33  79.76,20.5 0 top
R34  11.26,21.5 90 top
R35  44.26,21.5 90 top
R36  77.26,21.5 90 top
R37  14.01,9 270 top
R38  11.51,9 270 top
R39  25.01,9 270 top
R40  22.51,9 270 top
R41  36.01,9 270 top
R42  33.51,9 270 top
R43  47.01,9 270 top
R44  44.51,9 270 top
R45  58.01,9 270 top
R46  55.51,9 270 top
R47  69.01,9 270 top
R48  66.51,9 270 top
R49  80.01,9 270 top
R50  77.51,9 270 top
R51  91.01,9 270 top
R52  88.51,9 270 top
R53  102.01,9 270 top
R54  99.51,9 270 top
R55  178.01,27 0 top
R56  183.01,33 0 top  (outside the outline)
R57  117.01,22 90 top
R58  124.01,15 270 top
R59  128.01,15 270 top
R60  137.01,28 0 top
R61  137.01,36 0 top
R62  -18.99,-69 0 top  (outside the outline)
R63  -18.99,-74 0 top  (outside the outline)
R64  -18.99,-79 0 top  (outside the outline)
R65  -18.99,-84 0 top  (outside the outline)
R66  -18.99,-89 0 top  (outside the outline)
R67  -18.99,-94 0 top  (outside the outline)
R68  -18.99,-99 0 top  (outside the outline)
R69  -18.99,-104 0 top  (outside the outline)
R70  -18.99,-109 0 top  (outside the outline)
R71  54.01,-20 90 top  (outside the outline)
R72  59.01,-20 90 top  (outside the outline)
R74  69.01,-20 90 top  (outside the outline)
R75  74.01,-20 90 top  (outside the outline)
R76  79.01,-20 90 top  (outside the outline)
R77  84.01,-20 90 top  (outside the outline)
R78  114.51,6 270 top
R79  112.51,6 270 top
R80  124.51,6 270 top
R81  122.51,6 270 top
R82  134.51,6 270 top
R83  132.51,6 270 top
R84  144.51,6 270 top
R85  142.51,6 270 top
R86  154.51,6 270 top
R87  152.51,6 270 top
R88  164.51,6 270 top
R89  162.51,6 270 top
S1  -30.99,-94 0 top  (outside the outline)
S2  4.01,46 90 top
S3  4.01,74 90 top
SW1  112.51,2 0 top
SW2  112.01,61 180 top
SW3  122.51,2 0 top
SW4  132.51,2 0 top
SW5  142.51,2 0 top
SW6  152.51,2 0 top
SW7  162.51,2 0 top
U1  50.01,74 0 top
U2  123.51,70.4 180 top
U12  [TSSOP28']  23.76,20.25 270 top
U13  [TSSOP28']  56.76,20.25 270 top
U14  [TSSOP28']  89.76,20.25 270 top
U15  148.51,30.5 0 top
U16  153.01,32.5 0 top
U17  152.01,23 270 top
U19  24.01,36 270 top
U20  62.01,74 0 top
U$1  65.01,52 90 top
X1  112.51,3 180 bottom
X2  122.51,3 180 bottom
X3  132.51,3 180 bottom
X4  142.51,3 180 bottom
X5  152.51,3 180 bottom
X6  162.51,3 180 bottom

### Tracks (layer width: path | path; a pad name or v marks a point on that pad's centre or on a via)
3.3V  (22 unrouted)
9_AD1
  Top 0.254: C39.1 16.38,18.88 17.26,19.75 19.35,19.75 19.79,19.31 U12.9
9_AD2
  Top 0.254: C40.1 49.38,18.88 50.26,19.75 52.35,19.75 52.79,19.31 U13.9
9_AD3
  Top 0.254: C41.1 82.38,18.88 83.26,19.75 85.35,19.75 85.79,19.31 U14.9
15V_RC+  (1 unrouted)
15V_RC-  (1 unrouted)
23_AD1
  Top 0.254: R22.8 29.62,21.56 29.31,21.25 U12.23
23_AD2
  Top 0.254: R24.8 62.62,21.56 62.31,21.25 U13.23
23_AD3
  Top 0.254: R26.8 95.62,21.56 95.31,21.25 U14.23
24_AD1
  Top 0.254: R22.7 29.62,22.34 29.18,21.9 U12.24
24_AD2
  Top 0.254: R24.7 62.62,22.34 62.18,21.9 U13.24
24_AD3
  Top 0.254: R26.7 95.62,22.34 95.18,21.9 U14.24
25_AD1
  Top 0.254: R22.6 29.61,23.16 | 29.61,23.16 29.87,23.16 | U12.25 29,22.55 29.61,23.16
25_AD2
  Top 0.254: R24.6 62.61,23.16 | 62.61,23.16 62.87,23.16 | U13.25 62,22.55 62.61,23.16
25_AD3
  Top 0.254: R26.6 95.61,23.16 | 95.61,23.16 95.87,23.16 | U14.25 95,22.55 95.61,23.16
26_AD1
  Top 0.254: R22.5 29.62,23.94 28.88,23.2 U12.26
26_AD2
  Top 0.254: R24.5 62.62,23.94 61.88,23.2 U13.26
26_AD3
  Top 0.254: R26.5 95.62,23.94 94.88,23.2 U14.26
27_AD1
  Top 0.254: R23.8 29.62,25.55 27.92,23.85 U12.27
27_AD2
  Top 0.254: R25.8 62.62,25.55 60.92,23.85 U13.27
27_AD3
  Top 0.254: R27.8 95.62,25.55 93.92,23.85 U14.27
28_AD1
  Top 0.254: R23.7 29.62,26.34 27.78,24.5 U12.28
28_AD2
  Top 0.254: R25.7 62.62,26.34 60.78,24.5 U13.28
28_AD3
  Top 0.254: R27.7 95.62,26.34 93.78,24.5 U14.28
!ADCSUP_SD  (1 unrouted)
!CS!_AD1  (2 unrouted)
  Top 0.406: R22.2 34.39,22.34
!CS!_AD2  (2 unrouted)
  Top 0.406: R24.2 67.39,22.34
!CS!_AD3  (2 unrouted)
  Top 0.406: R26.2 100.39,22.34
!DRDY!_AD1  (2 unrouted)
  Top 0.406: R22.3 34.3,23.16
!DRDY!_AD2  (2 unrouted)
  Top 0.406: R24.3 67.3,23.16
!DRDY!_AD3  (2 unrouted)
  Top 0.406: R26.3 100.3,23.16
!RESET  (2 unrouted)
!RESET!_AD1
  Top 0.254: U12.4 19.11,22.55 R19.1
!RESET!_AD2
  Top 0.254: U13.4 52.11,22.55 R20.1
!RESET!_AD3
  Top 0.254: U14.4 85.11,22.55 R21.1
+5V  (4 unrouted)
+15V  (8 unrouted)
AD1_AIN0
  Top 0.254: U12.11 19.26,18 17.76,16.5 17.76,4.67 K17.4
AD1_AIN1  (via drill 0.3 pad 0.5)
  Top 0.254: C54.1 14.03,9.88 | 14.03,9.88 R37.1 | 14.03,9.88 14.03,11.6 C51.2 | U12.12 19.86,17.35 v19.01,16.5 | C51.2 14.01,12 | v16.76,16.5 16.76,16 arc-90 16.38,15.62 15.37,15.62 arc90 14.99,15.24 14.99,15.16 arc90 15.37,14.78 16.38,14.78 arc-90 16.76,14.39 16.76,14.31 arc-90 16.38,13.93 15.37,13.93 arc90 14.99,13.55 14.99,13.47 arc90 15.37,13.09 16.38,13.09 arc-90 16.76,12.71 16.76,12.5 16.26,12 C51.2
  Bottom 0.254: v19.01,16.5 v19.01,16.5 arc90 18.63,16.12 18.63,15.38 arc-90 18.25,15 17.52,15 arc-90 17.14,15.38 17.14,16.12 arc90 v16.76,16.5
AD1_AIN2  (via drill 0.3 pad 0.5)
  Top 0.254: C57.2 11.48,9.88 R38.1 11.51,11.62 | 11.51,11.62 C51.1 | U12.17 25.11,17.35 v25.01,17.25 | v15.76,17.25 11.51,13 11.51,11.62
  Bottom 0.254: v25.01,17.25 v15.76,17.25
AD1_AIN3
  Top 0.254: K18.4 28.26,3.5 28.26,5 28.34,11.42 23.76,16 23.76,17.5 24.26,18 U12.18
AD1_AIN4
  Top 0.254: C55.1 25.03,9.88 R39.1 25.01,11.5 25.01,11.62 | 25.01,11.62 C52.2 24.51,12.12 24.63,12.12 | 25.01,11.62 25.01,13.5 21.76,16.75 21.01,16.75 U12.13
AD1_AIN5
  Top 0.254: C58.2 22.48,9.88 R40.1 22.51,11.62 C52.1 20.51,12 20.26,12.25 20.26,13 arc-90 20.64,13.38 21.46,13.38 arc90 21.84,13.76 21.84,14.5 arc90 21.46,14.88 20.64,14.88 arc-90 20.26,15.26 20.26,16 20.91,16 U12.14
AD1_AIN6  (via drill 0.3 pad 0.5)
  Top 0.254: C53.2 36.01,11.62 R41.1 37.48,9.85 C56.1 | 36.01,12 C53.2 | 36.01,11.75 36.01,12.25 35.76,12 C53.2 | U12.15 26.76,15.85 v26.76,15.25 | C53.2 36.01,12.38 35.38,12.38 v32.51,15.25
  Bottom 0.254: v32.51,15.25 v26.76,15.25
AD1_AIN7
  Top 0.254: C59.2 33.48,9.88 | 33.48,9.88 R42.1 | 33.48,9.88 33.48,11.6 C53.1 32.32,13.56 arc90 31.78,13.56 31.63,13.41 arc-90 31.1,13.41 31.06,13.45 arc-90 31.06,13.99 31.21,14.14 arc90 31.21,14.68 31.17,14.72 arc90 30.63,14.72 30.48,14.57 arc-90 29.94,14.57 29.9,14.61 arc-90 29.9,15.14 30.05,15.29 arc90 30.05,15.83 29.18,16.7 U12.16
AD2_AIN0
  Top 0.254: U13.11 52.26,18 50.76,16.5 50.76,4.67 K20.4
AD2_AIN1  (via drill 0.3 pad 0.5)
  Top 0.254: C63.1 47.03,9.88 | 47.03,9.88 R43.1 | 47.03,9.88 47.03,11.35 C60.2 46.63,12 49.26,12 49.76,12.5 49.76,12.71 arc90 49.38,13.09 48.37,13.09 arc-90 47.99,13.47 47.99,13.55 arc-90 48.37,13.93 49.38,13.93 arc90 49.76,14.31 49.76,14.39 arc90 49.38,14.78 48.37,14.78 arc-90 47.99,15.16 47.99,15.24 arc-90 48.37,15.62 49.38,15.62 arc90 49.76,16 v49.76,16.5 | U13.12 52.86,17.35 v52.01,16.5
  Bottom 0.254: v52.01,16.5 v52.01,16.5 arc90 51.63,16.12 51.63,15.38 arc-90 51.25,15 50.52,15 arc-90 50.14,15.38 50.14,16.12 arc90 v49.76,16.5
AD2_AIN2  (via drill 0.3 pad 0.5)
  Top 0.254: C66.2 44.48,9.88 R44.1 44.51,11.25 44.51,11.38 | 44.51,11.38 C60.1 | U13.17 58.11,17.35 v58.01,17.25 | v48.76,17.25 44.51,13 44.51,11.38
  Bottom 0.254: v58.01,17.25 v48.76,17.25
AD2_AIN3
  Top 0.254: U13.18 57.26,18 56.76,17.5 56.76,16 61.34,11.42 61.26,5 61.26,4.17 K21.4
AD2_AIN4
  Top 0.254: C64.1 58.03,9.88 R45.1 58.01,11.12 C61.2 57.76,11.62 58.01,11.62 58.01,13.5 54.76,16.75 54.01,16.75 U13.13
AD2_AIN5
  Top 0.254: C67.2 55.48,9.88 R46.1 55.51,11.12 C61.1 55.88,12 53.51,12 53.26,12.25 53.26,13 arc-90 53.64,13.38 54.46,13.38 arc90 54.84,13.76 54.84,14.5 arc90 54.46,14.88 53.64,14.88 arc-90 53.26,15.26 53.26,16 53.91,16 U13.14
AD2_AIN6  (via drill 0.3 pad 0.5)
  Top 0.254: C65.1 69.03,9.88 R47.1 69.01,11.12 C62.2 68.38,11.75 68.38,12.38 v65.51,15.25 | U13.15 59.76,15.85 v59.76,15.25
  Bottom 0.254: v65.51,15.25 v59.76,15.25
AD2_AIN7
  Top 0.254: C68.2 66.48,9.88 R48.1 66.51,11.12 C62.1 66.88,12 65.32,13.56 arc90 64.78,13.56 64.63,13.41 arc-90 64.1,13.41 64.06,13.45 arc-90 64.06,13.99 64.21,14.14 arc90 64.21,14.68 64.17,14.72 arc90 63.63,14.72 63.48,14.57 arc-90 62.94,14.57 62.9,14.61 arc-90 62.9,15.14 63.05,15.29 arc90 63.05,15.83 62.18,16.7 U13.16
AD3_AIN0
  Top 0.254: U14.11 85.26,18 83.76,16.5 83.76,4.67 K23.4
AD3_AIN1  (via drill 0.3 pad 0.5)
  Top 0.254: C72.1 80.03,9.88 R49.1 80.01,11.12 C69.2 79.63,12 82.26,12 82.76,12.5 82.76,12.71 arc90 82.38,13.09 81.37,13.09 arc-90 80.99,13.47 80.99,13.55 arc-90 81.37,13.93 82.38,13.93 arc90 82.76,14.31 82.76,14.39 arc90 82.38,14.78 81.37,14.78 arc-90 80.99,15.16 80.99,15.24 arc-90 81.37,15.62 82.38,15.62 arc90 82.76,16 v82.76,16.5 | U14.12 85.86,17.35 v85.01,16.5
  Bottom 0.254: v85.01,16.5 v85.01,16.5 arc90 84.63,16.12 84.63,15.38 arc-90 84.25,15 83.52,15 arc-90 83.14,15.38 83.14,16.12 arc90 v82.76,16.5
AD3_AIN2  (via drill 0.3 pad 0.5)
  Top 0.254: C75.2 77.48,9.88 R50.1 77.51,11.12 C69.1 77.76,11.62 77.51,11.62 77.51,13 v81.76,17.25 | U14.17 91.11,17.35 v91.01,17.25
  Bottom 0.254: v91.01,17.25 v81.76,17.25
AD3_AIN3
  Top 0.254: U14.18 90.26,18 89.76,17.5 89.76,16 94.34,11.42 94.26,5 94.26,4.17 K24.4
AD3_AIN4
  Top 0.254: C73.1 91.03,9.88 R51.1 91.01,11.12 C70.2 90.76,11.62 91.01,11.62 91.01,13.5 87.76,16.75 87.01,16.75 U14.13
AD3_AIN5
  Top 0.254: C76.2 87.03,9.85 R52.1 88.51,11.12 C70.1 88.88,12 86.51,12 86.26,12.25 86.26,13 arc-90 86.64,13.38 87.46,13.38 arc90 87.84,13.76 87.84,14.5 arc90 87.46,14.88 86.64,14.88 arc-90 86.26,15.26 86.26,16 86.91,16 U14.14
AD3_AIN6  (via drill 0.3 pad 0.5)
  Top 0.254: C74.1 102.03,9.88 R53.1 102.01,11.12 C71.2 101.38,11.75 101.38,12.38 v98.51,15.25 | U14.15 92.76,15.85 v92.76,15.25
  Bottom 0.254: v98.51,15.25 v92.76,15.25
AD3_AIN7
  Top 0.254: C77.2 99.48,9.88 | 99.48,9.88 R54.1 | 99.48,9.88 99.48,11.1 C71.1 99.88,12 98.32,13.56 arc90 97.78,13.56 97.63,13.41 arc-90 97.1,13.41 97.06,13.45 arc-90 97.06,13.99 97.21,14.14 arc90 97.21,14.68 97.17,14.72 arc90 96.63,14.72 96.48,14.57 arc-90 95.94,14.57 95.9,14.61 arc-90 95.9,15.14 96.05,15.29 arc90 96.05,15.83 95.18,16.7 U14.16
ADC_3.3V  (15 unrouted)
  Top 0.254: C36.1 29.53,20.6 U12.22 | C33.1 22.88,25.38 22.01,24.5 U12.1 18.61,24.5 R19.2 | C34.1 55.88,25.38 55.01,24.5 U13.1 51.61,24.5 R20.2 | C35.1 88.88,25.38 88.01,24.5 U14.1 84.61,24.5 R21.2
BIASP_AD1
  Top 0.254: K19.1 30.97,2.96 30.01,2 21.47,2 K18.1 19.97,3.46 18.51,2 10.47,2 K17.1 8.97,3.54 7.51,5 7.51,16.1 7.51,18.75 11.11,22.35 R34.2 12.76,22.35 R28.1
BIASP_AD2  (2 unrouted)
  Top 0.254: R30.1 45.76,22.35 R35.2 44.11,22.35 40.51,18.75 40.51,4.96 K20.1
BIASP_AD3  (2 unrouted)
  Top 0.254: R32.1 78.76,22.35 R36.2 77.11,22.35 73.51,18.75 73.51,4.96 K23.1
EXTGPIO_!INT  (2 unrouted)
GND  (via drill 0.3 pad 0.5)  (146 unrouted)
  Top 0.254: U12.2 22.16,23.85 22.26,23.75 22.26,23.5 21.96,23.2 U12.3 | U12.21 25.06,19.95 v25.01,20 | U12.10 19.36,18.65 v19.26,18.75 | C36.2 v33.26,19.75 | C33.2 v25.76,26.25 | C42.1 v11.76,24.5 | 12.88,20.48 R29.1 | U13.2 55.16,23.85 55.26,23.75 55.26,23.5 54.96,23.2 U13.3 | U13.21 58.06,19.95 v58.01,20 | U13.10 52.36,18.65 v52.26,18.75 | C37.2 v66.26,19.75 | C34.2 v58.76,26.25 | C45.1 v44.76,24.5 | 44.41,20.5 R35.1 | 45.88,20.48 R31.1 | U14.2 88.16,23.85 88.26,23.75 88.26,23.5 87.96,23.2 U14.3 | U14.21 91.06,19.95 v91.01,20 | U14.10 85.36,18.65 v85.26,18.75 | C38.2 v99.26,19.75 | C35.2 v91.76,26.25 | C48.1 v77.76,24.5 | 77.41,20.5 R36.1 | 78.88,20.48 R33.1
  other vias: 9.51,7 16.01,7 11.76,19.5 44.76,19.5 77.76,19.5
GND1  (via drill 0.3 pad 0.5)  (1 unrouted)
  other vias: 20.51,7 26.51,7
GND2  (via drill 0.3 pad 0.5)  (1 unrouted)
  other vias: 32.01,7 37.51,7
GND3  (via drill 0.3 pad 0.5)  (1 unrouted)
  other vias: 43.01,7 48.51,7
GND4  (via drill 0.3 pad 0.5)  (1 unrouted)
  other vias: 54.01,7 59.51,7
GND5  (via drill 0.3 pad 0.5)  (1 unrouted)
  other vias: 65.01,7 70.51,7
GND6  (via drill 0.3 pad 0.5)  (1 unrouted)
  other vias: 76.01,7 81.51,7
GND7  (via drill 0.3 pad 0.5)  (1 unrouted)
  other vias: 87.01,7 92.51,7
GND8  (via drill 0.3 pad 0.5)  (1 unrouted)
  other vias: 98.01,7 103.51,7
GPIO0.0  (1 unrouted)
  Top 0.254: R79.1 110.53,6.85 C86.2
GPIO0.1  (1 unrouted)
  Top 0.254: R81.1 120.53,6.85 C87.2
GPIO0.2  (1 unrouted)
  Top 0.254: R83.1 130.53,6.85 C88.2
GPIO0.3  (1 unrouted)
  Top 0.254: R85.1 140.53,6.85 C89.2
GPIO0.4  (1 unrouted)
  Top 0.254: R87.1 150.53,6.85 C90.2
GPIO0.5  (1 unrouted)
  Top 0.254: R89.1 160.53,6.85 C91.2
GPIO0.6_OUT  (1 unrouted)
GPIO0.7_OUT  (1 unrouted)
GPIO1.6_IN  (2 unrouted)
GPIO1.7_IN  (2 unrouted)
GPIO6_OUT  (1 unrouted)
GPIO7_OUT  (1 unrouted)
HEATER_INTERLOCK  (3 unrouted)
HEATER_OE  (2 unrouted)
HEATER_PWR_EN  (4 unrouted)
IEXC1_AD1
  Top 0.254: U12.20 26.61,19.25 28.26,19.25 28.76,18.75 33.01,18.75 39.26,12.5 39.26,4.17 K19.4
IEXC1_AD2
  Top 0.254: U13.20 59.61,19.25 61.26,19.25 61.76,18.75 66.01,18.75 72.26,12.5 72.26,4.17 K22.4
IEXC1_AD3
  Top 0.254: U14.20 92.61,19.25 94.26,19.25 94.76,18.75 99.01,18.75 105.26,12.5 105.26,4.17 K25.4
IIC1_SCL  (3 unrouted)
IIC1_SDA  (3 unrouted)
MISO  (4 unrouted)
  Top 0.406: R22.4 33.95,23.94 34.26,24.25 | R24.4 66.95,23.94 67.26,24.25 | R26.4 99.95,23.94 100.26,24.25
MOSI  (4 unrouted)
  Top 0.406: R23.1 34.32,25.56 34.76,26 | R25.1 67.32,25.56 67.76,26 | R27.1 100.32,25.56 100.76,26
N$1  (1 unrouted)
N$20
  Top 0.254: R39.2 25.01,3.54 K18.3
N$22
  Top 0.254: R40.2 K18.2
N$23
  Top 0.254: R37.2 14.01,3.54 K17.3
N$25  (1 unrouted)
N$26  (1 unrouted)
N$27
  Top 0.254: K17.2 R38.2
N$28
  Top 0.254: R41.2 36.01,3.54 K19.3
N$30  (1 unrouted)
N$31
  Top 0.254: R42.2 K19.2
N$34
  Top 0.254: R43.2 47.01,3.54 K20.3
N$35
  Top 0.254: R44.2 K20.2
N$36  (1 unrouted)
N$37  (1 unrouted)
N$38  (1 unrouted)
N$41  (1 unrouted)
N$42
  Top 0.254: R45.2 58.01,3.54 K21.3
N$43
  Top 0.254: R46.2 K21.2
N$44
  Top 0.254: R47.2 69.01,3.54 K22.3
N$45
  Top 0.254: R48.2 K22.2
N$46
  Top 0.254: R49.2 80.01,3.54 K23.3
N$48
  Top 0.254: R50.2 K23.2
N$49
  Top 0.254: R51.2 91.01,3.54 K24.3
N$50
  Top 0.254: R52.2 K24.2
N$51
  Top 0.254: R53.2 102.01,3.54 K25.3
N$52
  Top 0.254: R54.2 K25.2
N$53  (1 unrouted)
N$54  (1 unrouted)
N$55  (1 unrouted)
N$60  (1 unrouted)
N$61  (1 unrouted)
N$62  (1 unrouted)
N$64  (via drill 0.35 pad 0.61)  (1 unrouted)
  Top 0.254: R79.2 R78.2 114.18,4.83 SW1.3 114.16,2.75 v112.51,2.75
  Bottom 0.254: X1.2 v112.51,2.75
N$66  (via drill 0.35 pad 0.61)  (1 unrouted)
  Top 0.254: R81.2 R80.2 124.18,4.83 SW3.3 124.16,2.75 v122.51,2.75
  Bottom 0.254: X2.2 v122.51,2.75
N$68  (via drill 0.35 pad 0.61)  (1 unrouted)
  Top 0.254: R83.2 R82.2 134.18,4.83 SW4.3 134.16,2.75 v132.51,2.75
  Bottom 0.254: v132.51,2.75 X3.2
N$70  (via drill 0.35 pad 0.61)  (1 unrouted)
  Top 0.254: R85.2 R84.2 144.18,4.83 SW5.3 144.16,2.75 v142.51,2.75
  Bottom 0.254: X4.2 v142.51,2.75
N$72  (via drill 0.35 pad 0.61)  (1 unrouted)
  Top 0.254: R87.2 R86.2 154.18,4.83 SW6.3 154.16,2.75 v152.51,2.75
  Bottom 0.254: X5.2 v152.51,2.75
N$79  (via drill 0.35 pad 0.61)  (1 unrouted)
  Top 0.254: R89.2 R88.2 164.18,4.83 SW7.3 164.16,2.75 v162.51,2.75
  Bottom 0.254: X6.2 v162.51,2.75
N$88  (1 unrouted)
N$89  (1 unrouted)
N$90  (1 unrouted)
N$91  (1 unrouted)
N$92  (1 unrouted)
N$93  (1 unrouted)
N$94  (1 unrouted)
N$95  (1 unrouted)
N$96  (1 unrouted)
N$97  (1 unrouted)
N$98  (1 unrouted)
N$99  (1 unrouted)
N$100  (1 unrouted)
N$101  (1 unrouted)
N$102  (1 unrouted)
N$103  (1 unrouted)
N$104  (1 unrouted)
N$105  (1 unrouted)
N$106  (1 unrouted)
N$107  (1 unrouted)
N$108  (1 unrouted)
PWM_SEG0  (1 unrouted)
PWM_SEG1  (1 unrouted)
PWM_SEG2  (1 unrouted)
PWM_SEG3  (1 unrouted)
PWM_SEG4  (1 unrouted)
PWM_SEG5  (1 unrouted)
PWM_SEG6  (1 unrouted)
PWM_SEG7  (1 unrouted)
PWM_SEG8  (1 unrouted)
PWM_SEG9  (1 unrouted)
PWM_SEG10  (1 unrouted)
PWM_SEG11  (1 unrouted)
PWM_SEG12  (1 unrouted)
PWM_SEG13  (1 unrouted)
PWM_SEG14  (1 unrouted)
PWM_SEG15  (1 unrouted)
REFN0_AD1
  Top 0.254: U12.6 16.88,21.25 C43.2 14.73,20.62 R29.2 14.61,18.77 C44.1
REFN0_AD2
  Top 0.254: U13.6 49.88,21.25 C46.2 47.73,20.62 R31.2 47.61,18.77 C47.1
REFN0_AD3
  Top 0.254: U14.6 82.88,21.25 C49.2 80.73,20.62 R33.2 80.61,18.77 C50.1
REFP0_AD1
  Top 0.254: U12.5 16.73,21.9 C43.1 16.13,22.5 R28.2 14.61,24.48 C42.2
REFP0_AD2
  Top 0.254: U13.5 49.73,21.9 C46.1 49.13,22.5 R30.2 47.61,24.48 C45.2
REFP0_AD3
  Top 0.254: U14.5 82.73,21.9 C49.1 82.13,22.5 R32.2 80.61,24.48 C48.2
RS485+  (2 unrouted)
RS485-  (2 unrouted)
SCK  (4 unrouted)
  Top 0.406: R23.2 34.1,26.34 34.51,26.75 | R25.2 67.1,26.34 67.51,26.75 | R27.2 100.1,26.34 100.51,26.75
SELSW1  (2 unrouted)
SELSW2  (2 unrouted)
START_AD1  (1 unrouted)
  Top 0.406: R22.1 34.38,21.56 33.9,21.54
START_AD2  (1 unrouted)
  Top 0.406: R24.1 67.38,21.56 66.9,21.54
START_AD3  (1 unrouted)
  Top 0.406: R26.1 100.38,21.56 99.9,21.54
TREG_3.3V  (15 unrouted)
UART_DE  (1 unrouted)
UART_RX  (2 unrouted)
UART_TX  (2 unrouted)